# EAGLE design qo-100-pa-bias-controller (EAGLE 9.6.1)
CNAME: None; CREVISION: 1; DESIGNER: Joao Silva

## Sheet 1 of 3: MCU
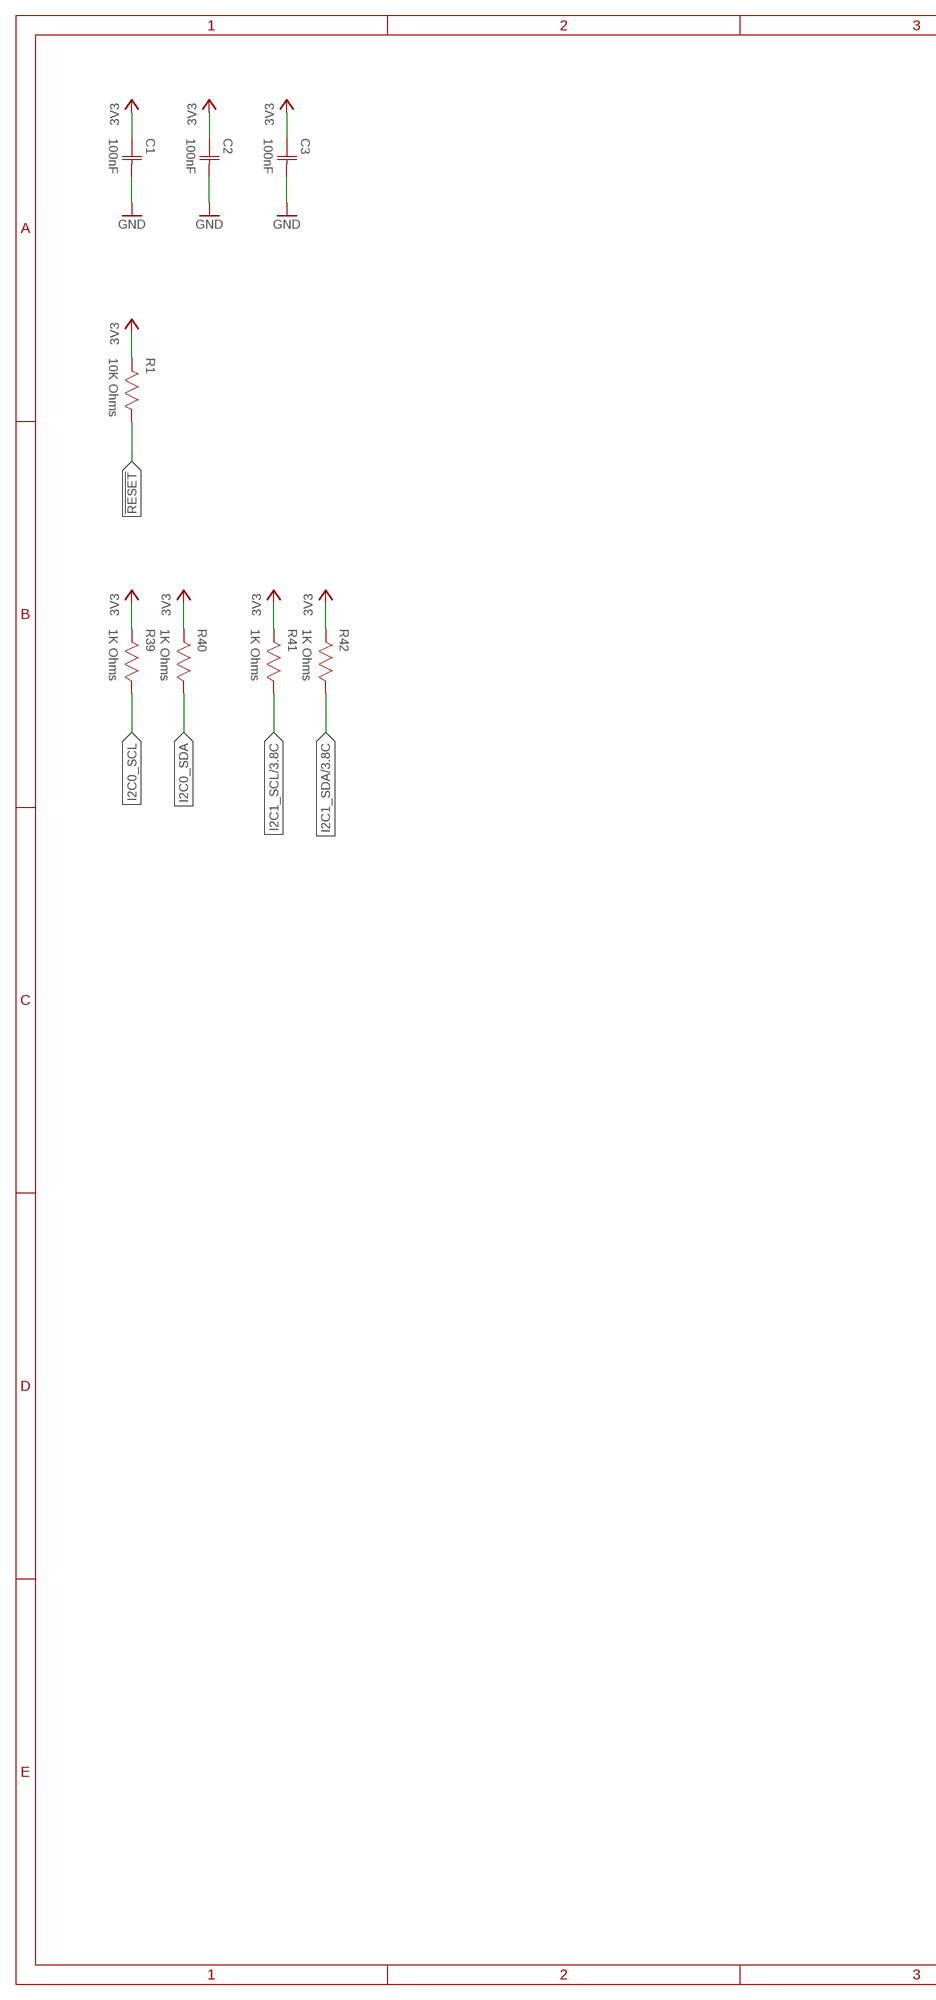
[diagram p0: schematic, sheet 1, part 1 of 2]
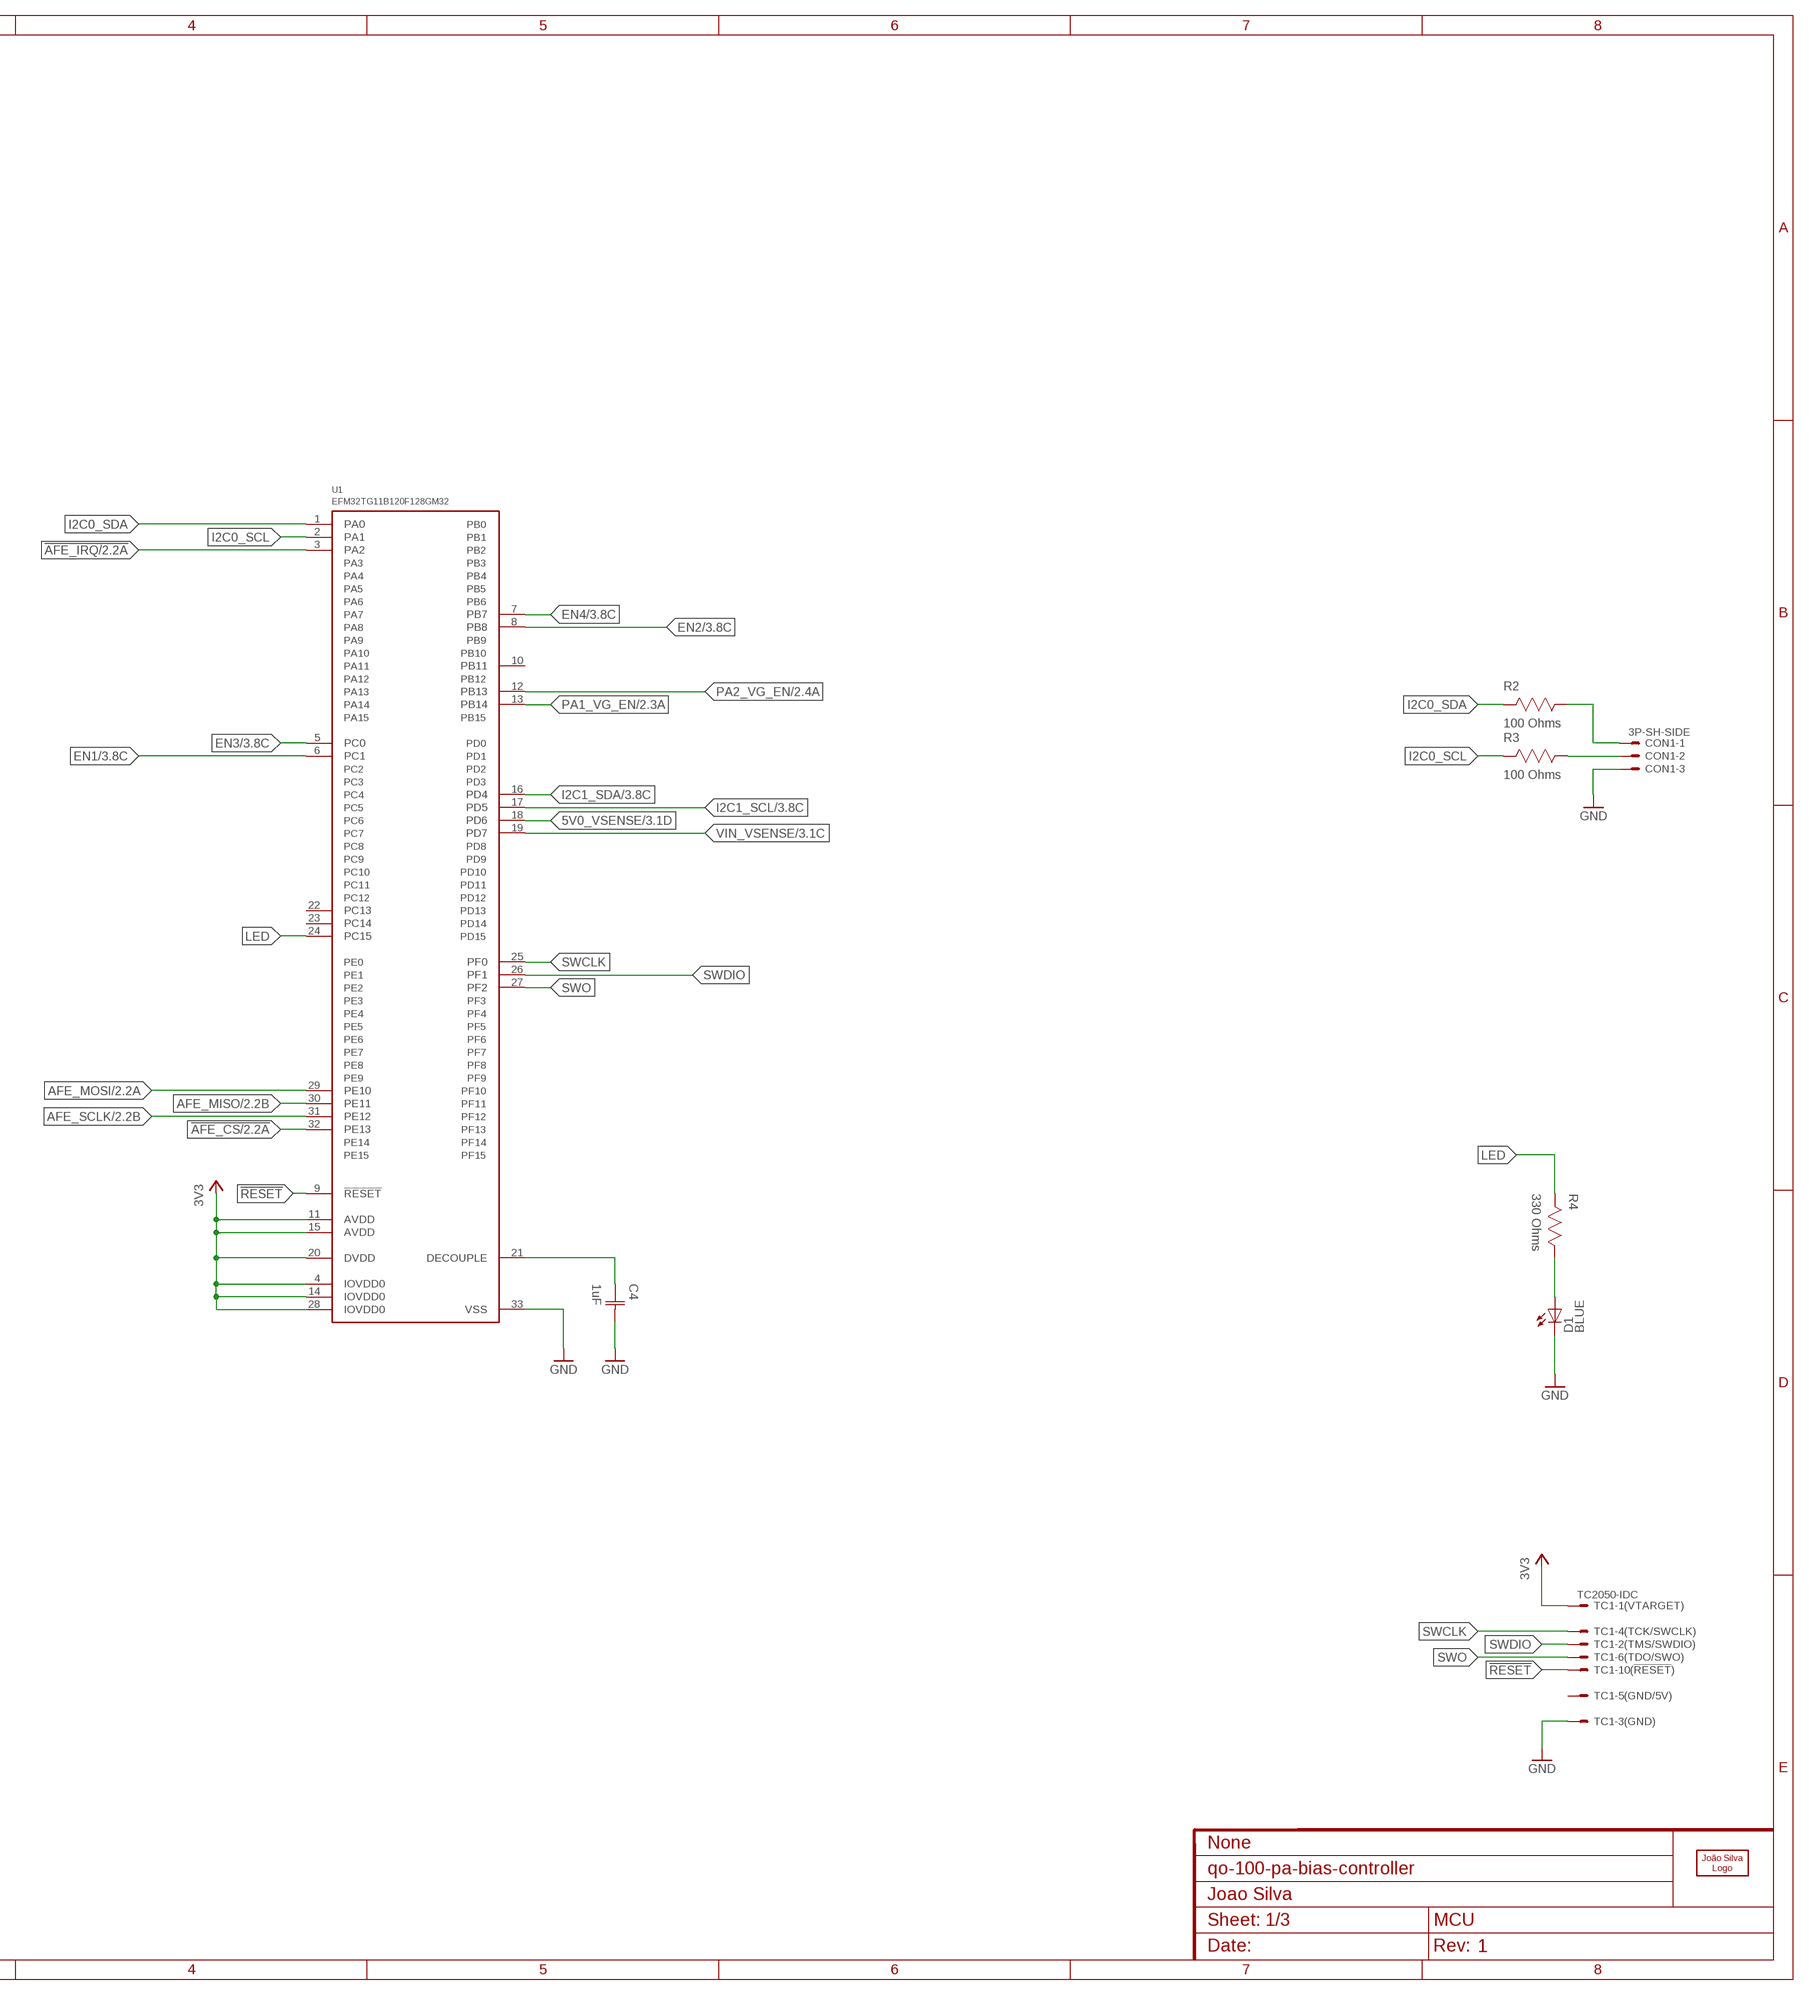
[diagram p1: schematic, sheet 1, part 2 of 2]

### Parts
C1  100nF  CAPACITOR-0603  [CAP0603]
C2  100nF  CAPACITOR-0603  [CAP0603]
C3  100nF  CAPACITOR-0603  [CAP0603]
C4  1uF  CAPACITOR-0603  [CAP0603]
CON1  3P-SH-SIDE  [SH-03-SIDE]
D1  LED0603  [0603]
LOGO1  JS-10MM  [JS_10MM]
R1  10K Ohms  RESISTOR-0603  [RES0603]
R2  100 Ohms  RESISTOR-0603  [RES0603]
R3  100 Ohms  RESISTOR-0603  [RES0603]
R4  330 Ohms  RESISTOR-0603  [RES0603]
R39  1K Ohms  RESISTOR-0603  [RES0603]
R40  1K Ohms  RESISTOR-0603  [RES0603]
R41  1K Ohms  RESISTOR-0603  [RES0603]
R42  1K Ohms  RESISTOR-0603  [RES0603]
TC1  TC2050-IDC  [TC2050-IDC]
U1  EFM32TG11B120F128GM32  [QFN32_0.5P_TG]

### Nets
3V3: C1.1(C1) C2.1(C1) C3.1(C1) R1.2 R39.2 R40.2 R41.2 R42.2 TC1.1 U1.4(IOVDD0) U1.11(AVDD) U1.14(IOVDD0) U1.15(AVDD) U1.20(DVDD) U1.28(IOVDD0) ; also sheet 2,3
5V0_VSENSE: U1.18(PD6) ; also sheet 3
!AFE_CS: U1.32(PE13) ; also sheet 2
!AFE_IRQ: U1.3(PA2) ; also sheet 2
!RESET: R1.1 TC1.10 U1.9(!RESET)
AFE_MISO: U1.30(PE11) ; also sheet 2
AFE_MOSI: U1.29(PE10) ; also sheet 2
AFE_SCLK: U1.31(PE12) ; also sheet 2
EN1: U1.6(PC1) ; also sheet 3
EN2: U1.8(PB8) ; also sheet 3
EN3: U1.5(PC0) ; also sheet 3
EN4: U1.7(PB7) ; also sheet 3
GND: C1.2(C2) C2.2(C2) C3.2(C2) C4.2(C2) CON1.3 D1.C TC1.3 U1.33(VSS) ; also sheet 2,3
I2C0_SCL: R3.2 R39.1 U1.2(PA1)
I2C0_SDA: R2.2 R40.1 U1.1(PA0)
I2C1_SCL: R41.1 U1.17(PD5) ; also sheet 3
I2C1_SDA: R42.1 U1.16(PD4) ; also sheet 3
LED: R4.2 U1.24(PC15)
N$4: CON1.2 R3.1
N$6: C4.1(C1) U1.21(DECOUPLE)
N$25: D1.A R4.1
N$38: CON1.1 R2.1
PA1_VG_EN: U1.13(PB14) ; also sheet 2
PA2_VG_EN: U1.12(PB13) ; also sheet 2
SWCLK: TC1.4 U1.25(PF0)
SWDIO: TC1.2 U1.26(PF1)
SWO: TC1.6 U1.27(PF2)
VIN_VSENSE: U1.19(PD7) ; also sheet 3
Unconnected: TC1.5 TC1.7 TC1.8 TC1.9 U1.10(PB11) U1.22(PC13) U1.23(PC14)

## Sheet 2 of 3: Analog Frontend
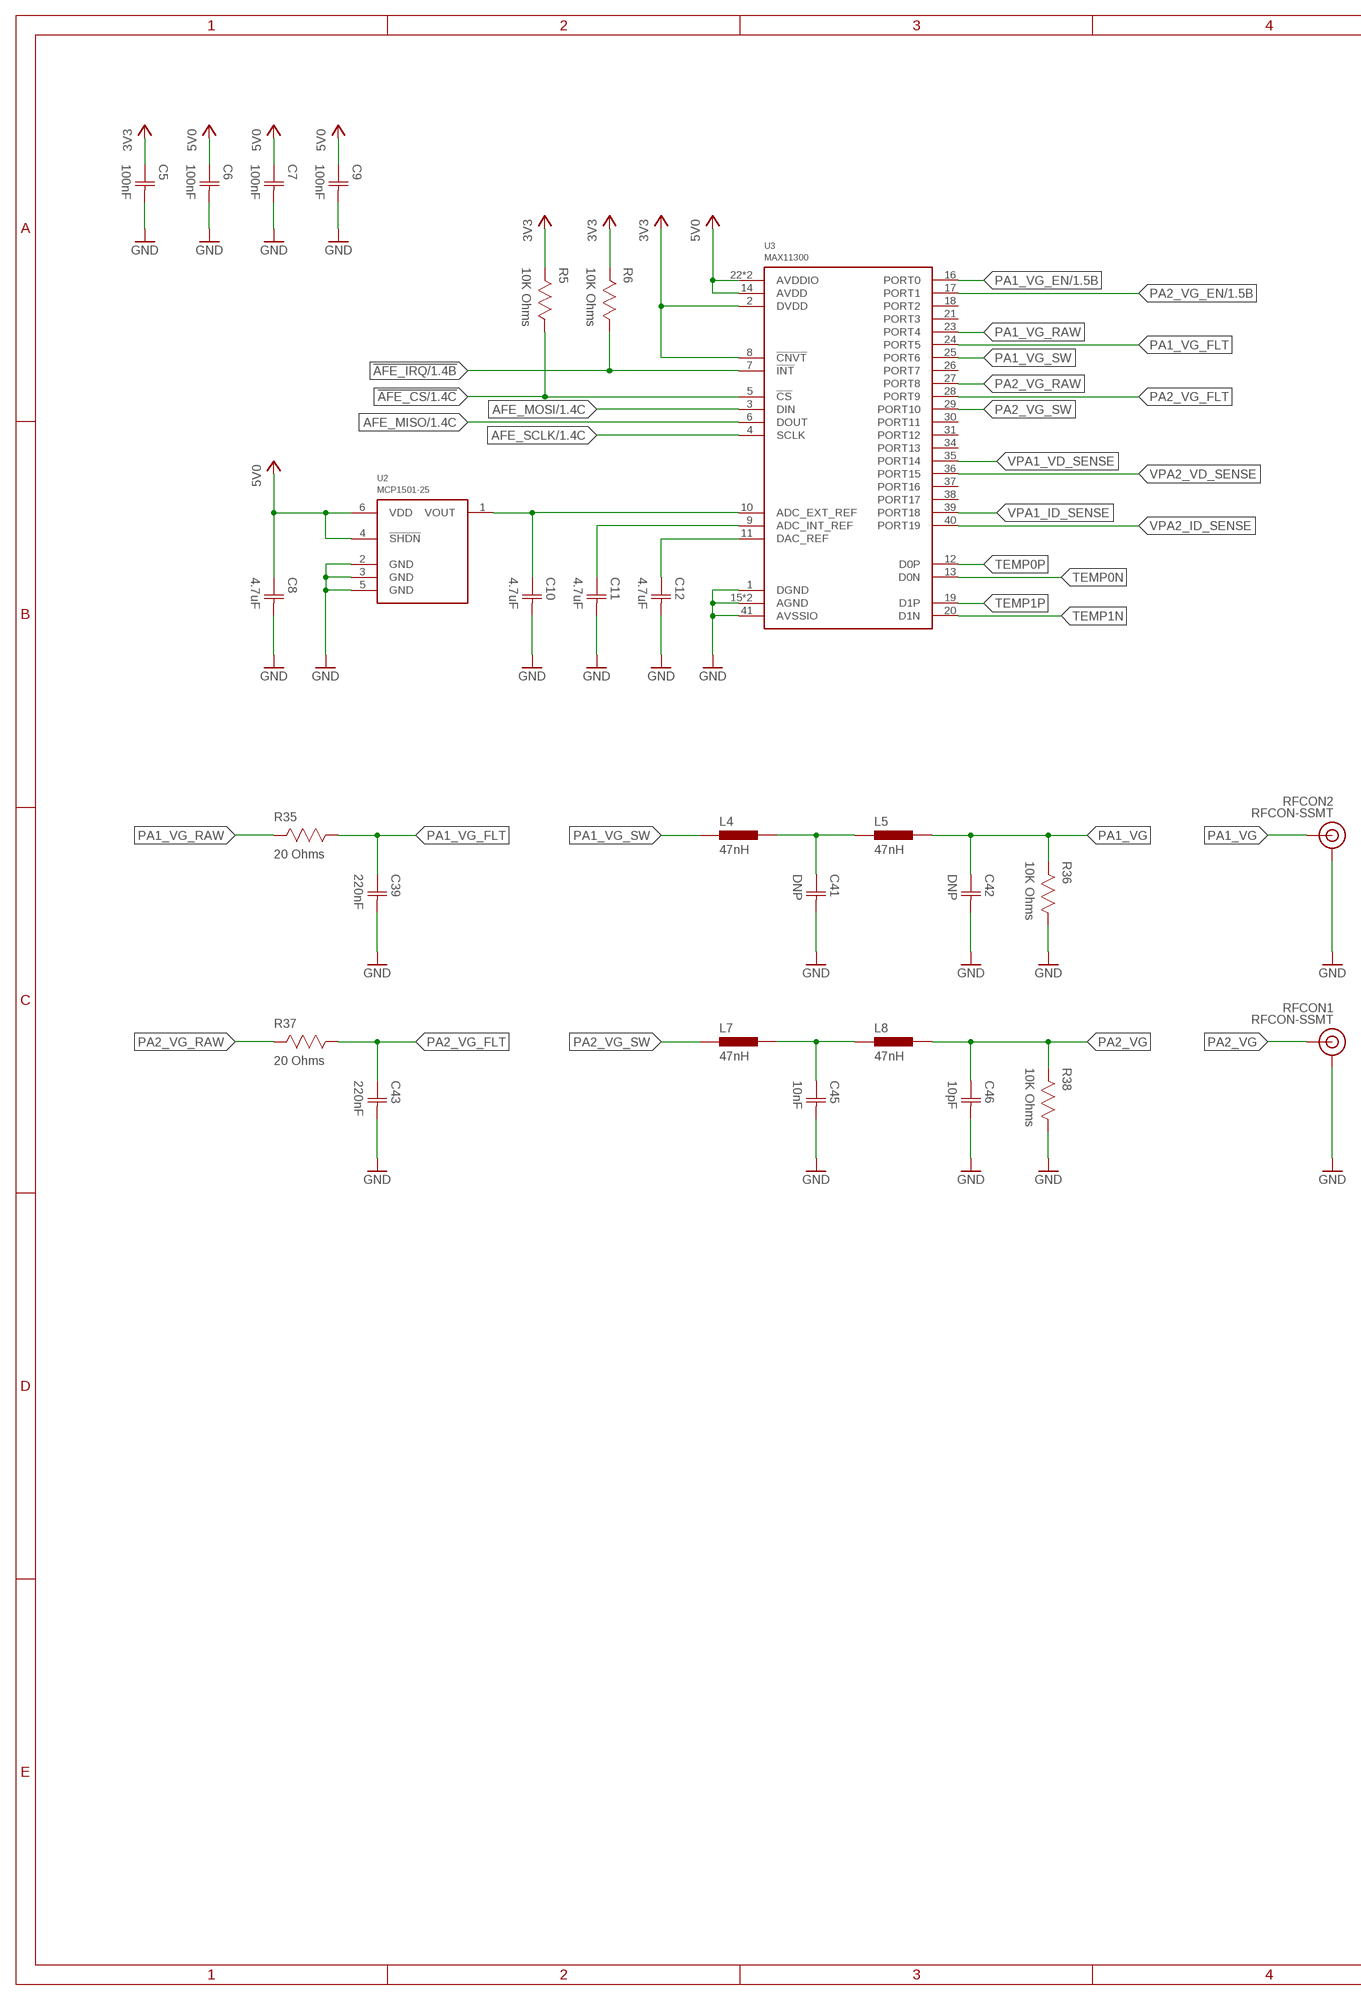
[diagram p2: schematic, sheet 2, part 1 of 2]
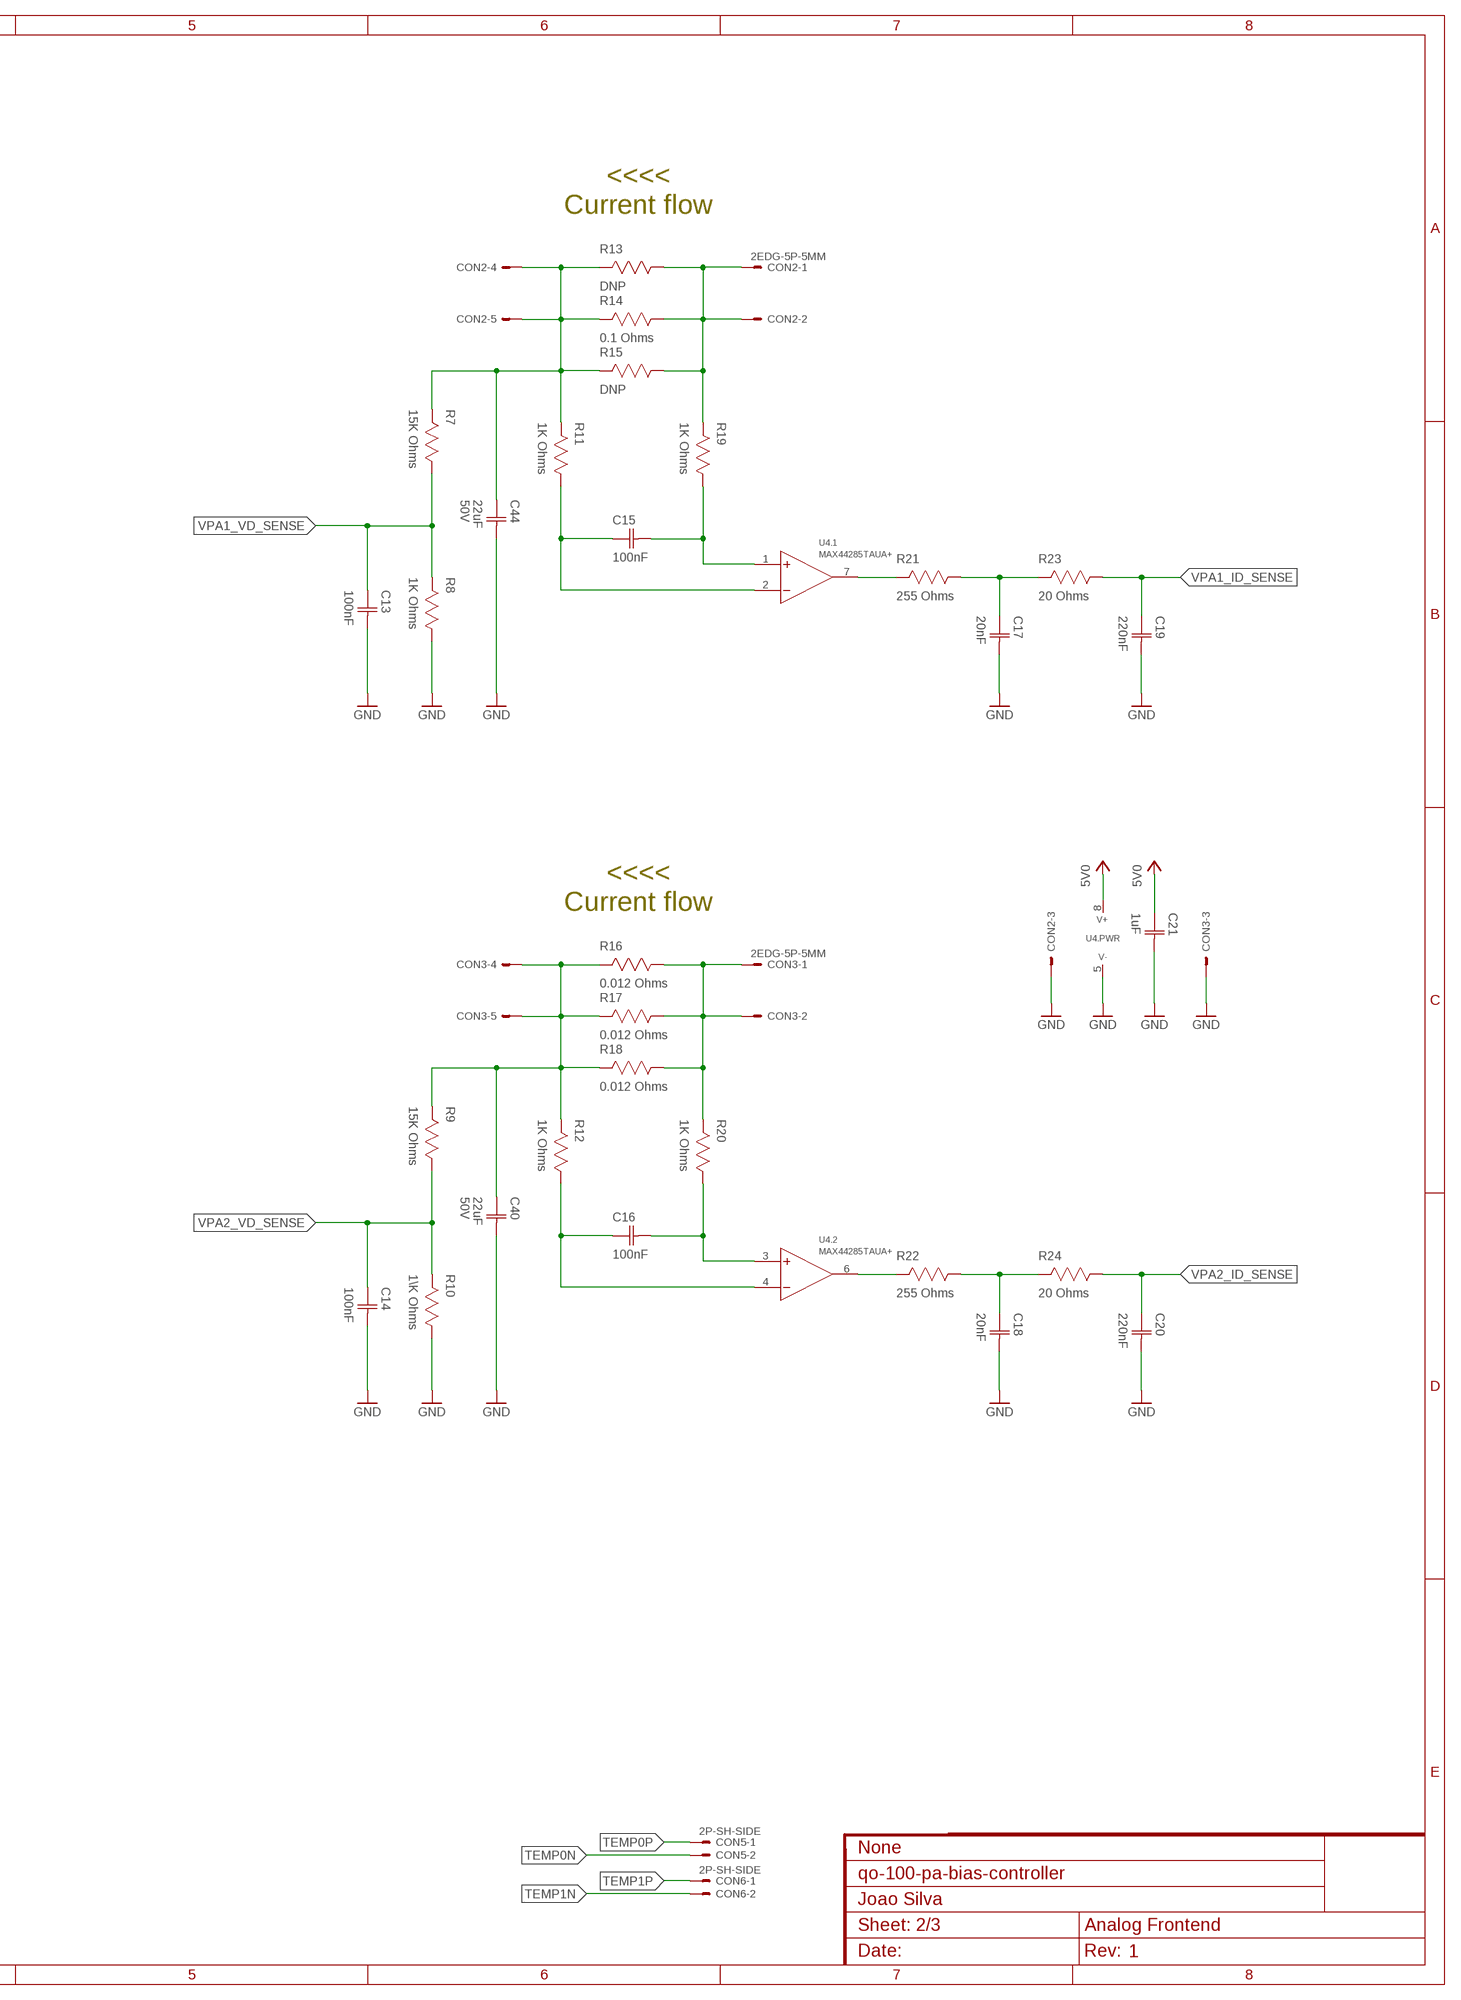
[diagram p3: schematic, sheet 2, part 2 of 2]

### Parts
C5  100nF  CAPACITOR-0603  [CAP0603]
C6  100nF  CAPACITOR-0603  [CAP0603]
C7  100nF  CAPACITOR-0603  [CAP0603]
C8  4.7uF  CAPACITOR-0603  [CAP0603]
C9  100nF  CAPACITOR-0603  [CAP0603]
C10  4.7uF  CAPACITOR-0603  [CAP0603]
C11  4.7uF  CAPACITOR-0603  [CAP0603]
C12  4.7uF  CAPACITOR-0603  [CAP0603]
C13  100nF  CAPACITOR-0603  [CAP0603]
C14  100nF  CAPACITOR-0603  [CAP0603]
C15  100nF  CAPACITOR-0603  [CAP0603]
C16  100nF  CAPACITOR-0603  [CAP0603]
C17  20nF  CAPACITOR-0603  [CAP0603]
C18  20nF  CAPACITOR-0603  [CAP0603]
C19  220nF  CAPACITOR-0603  [CAP0603]
C20  220nF  CAPACITOR-0603  [CAP0603]
C21  1uF  CAPACITOR-0603  [CAP0603]
C39  220nF  CAPACITOR-0603  [CAP0603]
C40  22uF  CAPACITOR-2220  [CAP2220]
C41  DNP  CAPACITOR-0603  [CAP0603]
C42  DNP  CAPACITOR-0603  [CAP0603]
C43  220nF  CAPACITOR-0603  [CAP0603]
C44  22uF  CAPACITOR-2220  [CAP2220]
C45  10nF  CAPACITOR-0603  [CAP0603]
C46  10pF  CAPACITOR-0603  [CAP0603]
CON2  2EDG-5P-5MM  [2EDG-5P-5MM]
CON3  2EDG-5P-5MM  [2EDG-5P-5MM]
CON5  2P-SH-SIDE  [SH-02-SIDE]
CON6  2P-SH-SIDE  [SH-02-SIDE]
L4  47nH  INDUCTOR-0603  [IND0603]
L5  47nH  INDUCTOR-0603  [IND0603]
L7  47nH  INDUCTOR-0603  [IND0603]
L8  47nH  INDUCTOR-0603  [IND0603]
R5  10K Ohms  RESISTOR-0603  [RES0603]
R6  10K Ohms  RESISTOR-0603  [RES0603]
R7  15K Ohms  RESISTOR-0603  [RES0603]
R8  1K Ohms  RESISTOR-0603  [RES0603]
R9  15K Ohms  RESISTOR-0603  [RES0603]
R10  1\K Ohms  RESISTOR-0603  [RES0603]
R11  1K Ohms  RESISTOR-0603  [RES0603]
R12  1K Ohms  RESISTOR-0603  [RES0603]
R13  DNP  RESISTOR-2512  [RES2512]
R14  0.1 Ohms  RESISTOR-2512  [RES2512]
R15  DNP  RESISTOR-2512  [RES2512]
R16  0.012 Ohms  RESISTOR-2512  [RES2512]
R17  0.012 Ohms  RESISTOR-2512  [RES2512]
R18  0.012 Ohms  RESISTOR-2512  [RES2512]
R19  1K Ohms  RESISTOR-0603  [RES0603]
R20  1K Ohms  RESISTOR-0603  [RES0603]
R21  255 Ohms  RESISTOR-0603  [RES0603]
R22  255 Ohms  RESISTOR-0603  [RES0603]
R23  20 Ohms  RESISTOR-0603  [RES0603]
R24  20 Ohms  RESISTOR-0603  [RES0603]
R35  20 Ohms  RESISTOR-0603  [RES0603]
R36  10K Ohms  RESISTOR-0603  [RES0603]
R37  20 Ohms  RESISTOR-0603  [RES0603]
R38  10K Ohms  RESISTOR-0603  [RES0603]
RFCON1  RFCON-SSMT  [SSMT]
RFCON2  RFCON-SSMT  [SSMT]
U2  MCP1501-25  [SOT23-6]
U3  MAX11300  [QFN40]
U4  MAX44285TAUA+  [MSOP8]

### Nets
3V3: C5.1(C1) R5.2 R6.2 U3.2(DVDD) U3.8(!CNVT) ; also sheet 1,3
5V0: C6.1(C1) C7.1(C1) C8.1(C1) C9.1(C1) C21.1(C1) U2.4(!SHDN) U2.6(VDD) U3.14(AVDD) U3.22(AVDDIO) U3.33(AVDDIO) U4.8(.PWR:V+) ; also sheet 3
!AFE_CS: R5.1 U3.5(!CS) ; also sheet 1
!AFE_IRQ: R6.1 U3.7(!INT) ; also sheet 1
AFE_ADC_EXT_REF: C10.1(C1) U2.1(VOUT) U3.10(ADC_EXT_REF)
AFE_ADC_INT_REF: C11.1(C1) U3.9(ADC_INT_REF)
AFE_DAC_REF: C12.1(C1) U3.11(DAC_REF)
AFE_MISO: U3.6(DOUT) ; also sheet 1
AFE_MOSI: U3.3(DIN) ; also sheet 1
AFE_SCLK: U3.4(SCLK) ; also sheet 1
GND: C5.2(C2) C6.2(C2) C7.2(C2) C8.2(C2) C9.2(C2) C10.2(C2) C11.2(C2) C12.2(C2) C13.2(C2) C14.2(C2) C17.2(C2) C18.2(C2) C19.2(C2) C20.2(C2) C21.2(C2) C39.2(C2) C40.2(C2) C41.2(C2) C42.2(C2) C43.2(C2) C44.2(C2) C45.2(C2) C46.2(C2) CON2.P$3 CON3.P$3 R8.1 R10.1 R36.1 R38.1 RFCON1.1(GND) RFCON1.3(GND) RFCON1.4(GND) RFCON2.1(GND) RFCON2.3(GND) RFCON2.4(GND) U2.2(GND) U2.3(GND) U2.5(GND) U3.1(DGND) U3.15(AGND) U3.32(AGND) U3.41(AVSSIO) U4.5(.PWR:V-) ; also sheet 1,3
N$1: R22.2 U4.6(.2:OUT)
N$2: C18.1(C1) R22.1 R24.2
N$3: R21.2 U4.7(.1:OUT)
N$5: C17.1(C1) R21.1 R23.2
N$8: C41.1(C1) L4.2 L5.1
N$10: C45.1(C1) L7.2 L8.1
PA1_VD_IN [80V isolation]: CON2.P$1 CON2.P$2 R13.1 R14.1 R15.1 R19.2
PA1_VD_OUT [80V isolation]: C44.1(C1) CON2.P$4 CON2.P$5 R7.2 R11.2 R13.2 R14.2 R15.2
PA1_VG: C42.1(C1) L5.2 R36.2 RFCON2.2(SIGNAL)
PA1_VG_EN: U3.16(PORT0) ; also sheet 1
PA1_VG_FLT: C39.1(C1) R35.1 U3.24(PORT5)
PA1_VG_RAW: R35.2 U3.23(PORT4)
PA1_VG_SW: L4.1 U3.25(PORT6)
PA2_VD_IN [80V isolation]: CON3.P$1 CON3.P$2 R16.1 R17.1 R18.1 R20.2
PA2_VD_OUT [80V isolation]: C40.1(C1) CON3.P$4 CON3.P$5 R9.2 R12.2 R16.2 R17.2 R18.2
PA2_VG: C46.1(C1) L8.2 R38.2 RFCON1.2(SIGNAL)
PA2_VG_EN: U3.17(PORT1) ; also sheet 1
PA2_VG_FLT: C43.1(C1) R37.1 U3.28(PORT9)
PA2_VG_RAW: R37.2 U3.27(PORT8)
PA2_VG_SW: L7.1 U3.29(PORT10)
TEMP0N: CON5.2 U3.13(D0N)
TEMP0P: CON5.1 U3.12(D0P)
TEMP1N: CON6.2 U3.20(D1N)
TEMP1P: CON6.1 U3.19(D1P)
VPA1_ID_SENSE: C19.1(C1) R23.1 U3.39(PORT18)
VPA1_ID_SENSE_N [80V isolation]: C15.1(C1) R11.1 U4.2(.1:-IN)
VPA1_ID_SENSE_P [80V isolation]: C15.2(C2) R19.1 U4.1(.1:+IN)
VPA1_VD_SENSE: C13.1(C1) R7.1 R8.2 U3.35(PORT14)
VPA2_ID_SENSE: C20.1(C1) R24.1 U3.40(PORT19)
VPA2_ID_SENSE_N [80V isolation]: C16.1(C1) R12.1 U4.4(.2:-IN)
VPA2_ID_SENSE_P [80V isolation]: C16.2(C2) R20.1 U4.3(.2:+IN)
VPA2_VD_SENSE: C14.1(C1) R9.1 R10.2 U3.36(PORT15)
Unconnected: U3.18(PORT2) U3.21(PORT3) U3.26(PORT7) U3.30(PORT11) U3.31(PORT12) U3.34(PORT13) U3.37(PORT16) U3.38(PORT17)

### Notes on the sheet
- <<<<
  Current flow
- <<<<
  Current flow

## Sheet 3 of 3: Power
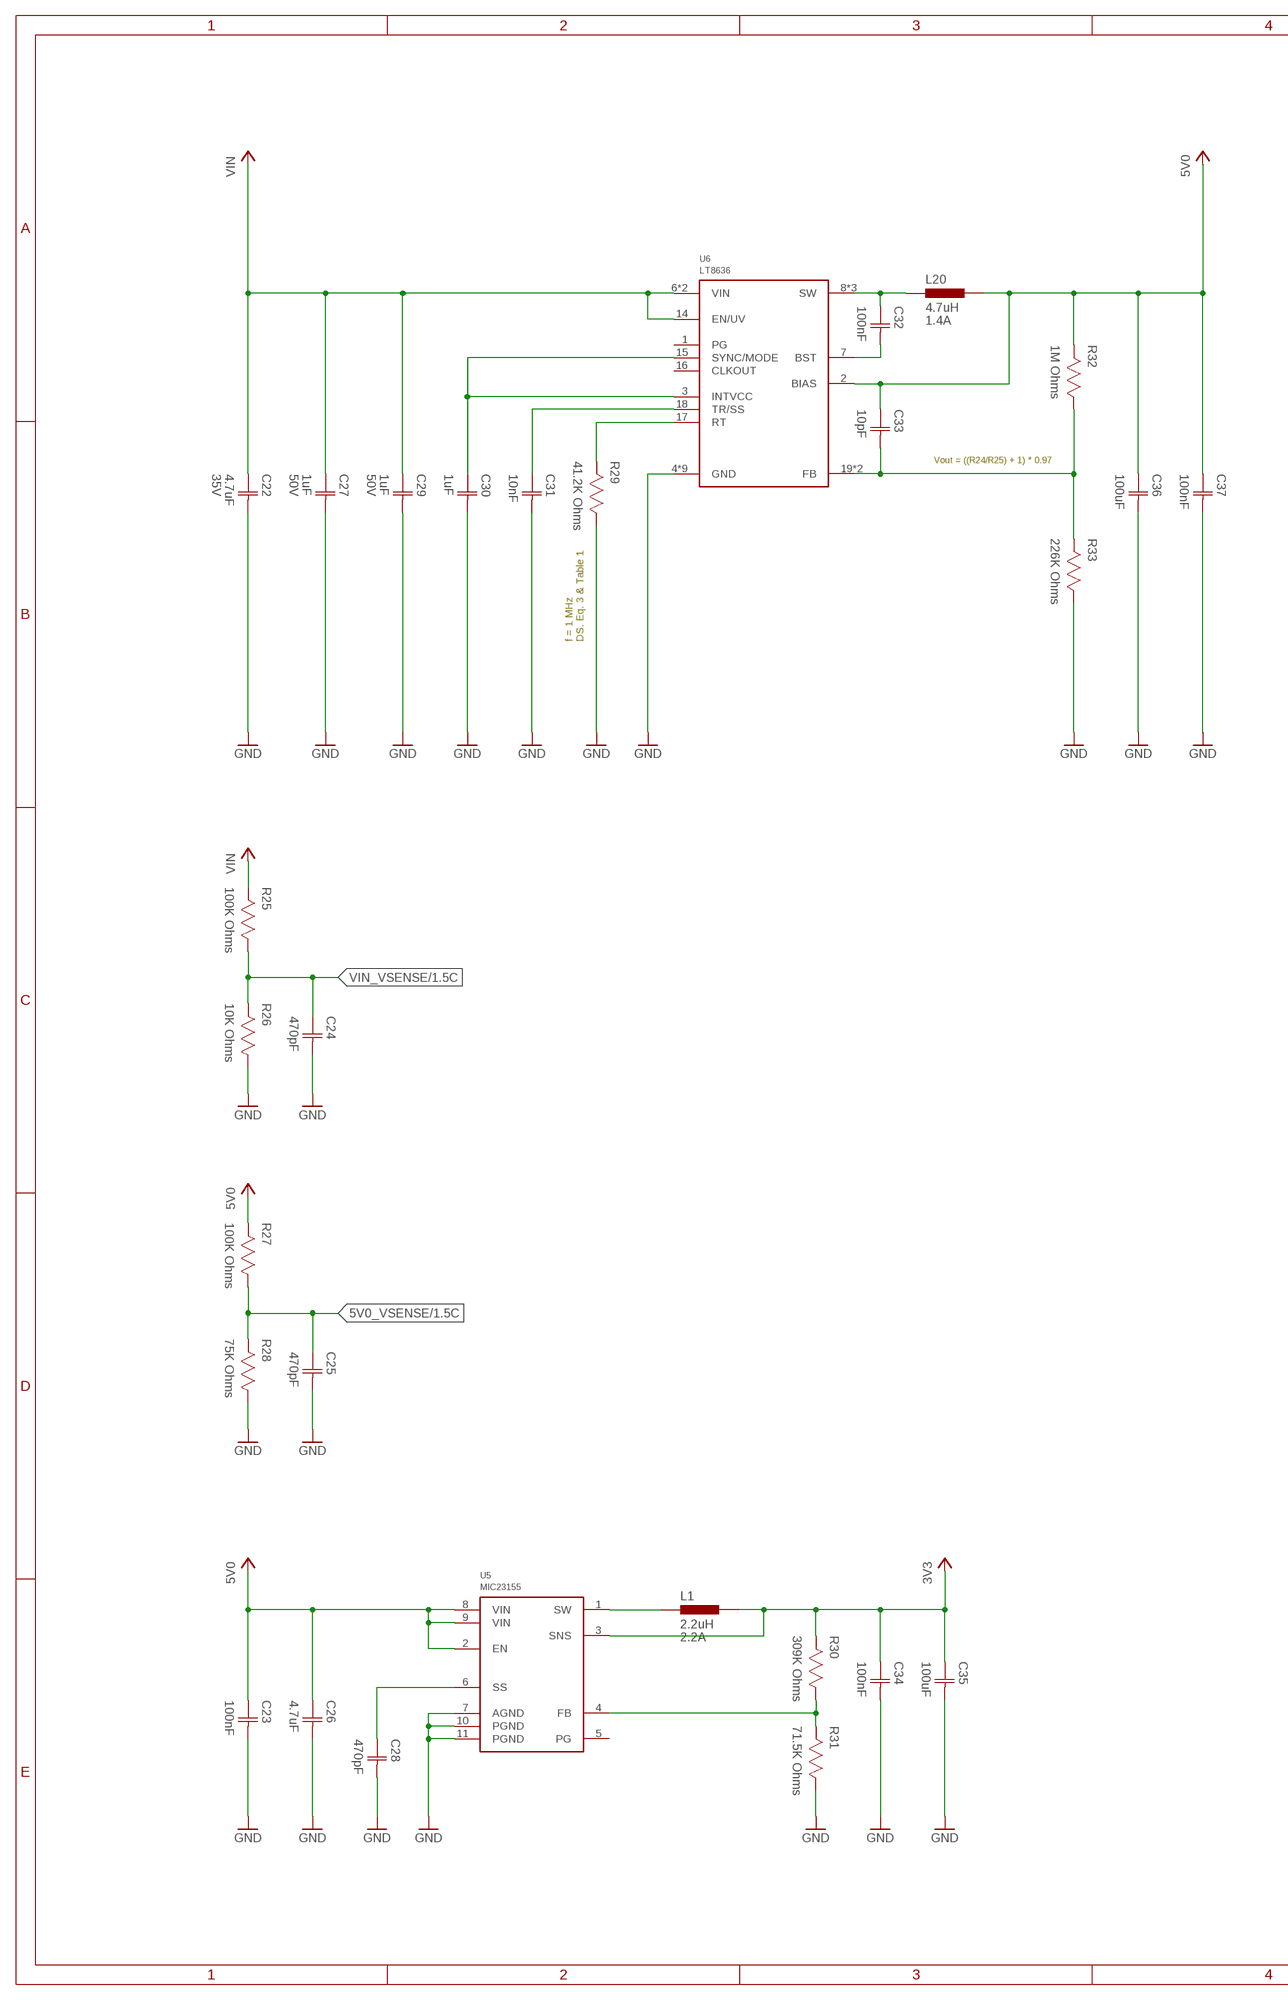
[diagram p4: schematic, sheet 3, part 1 of 2]
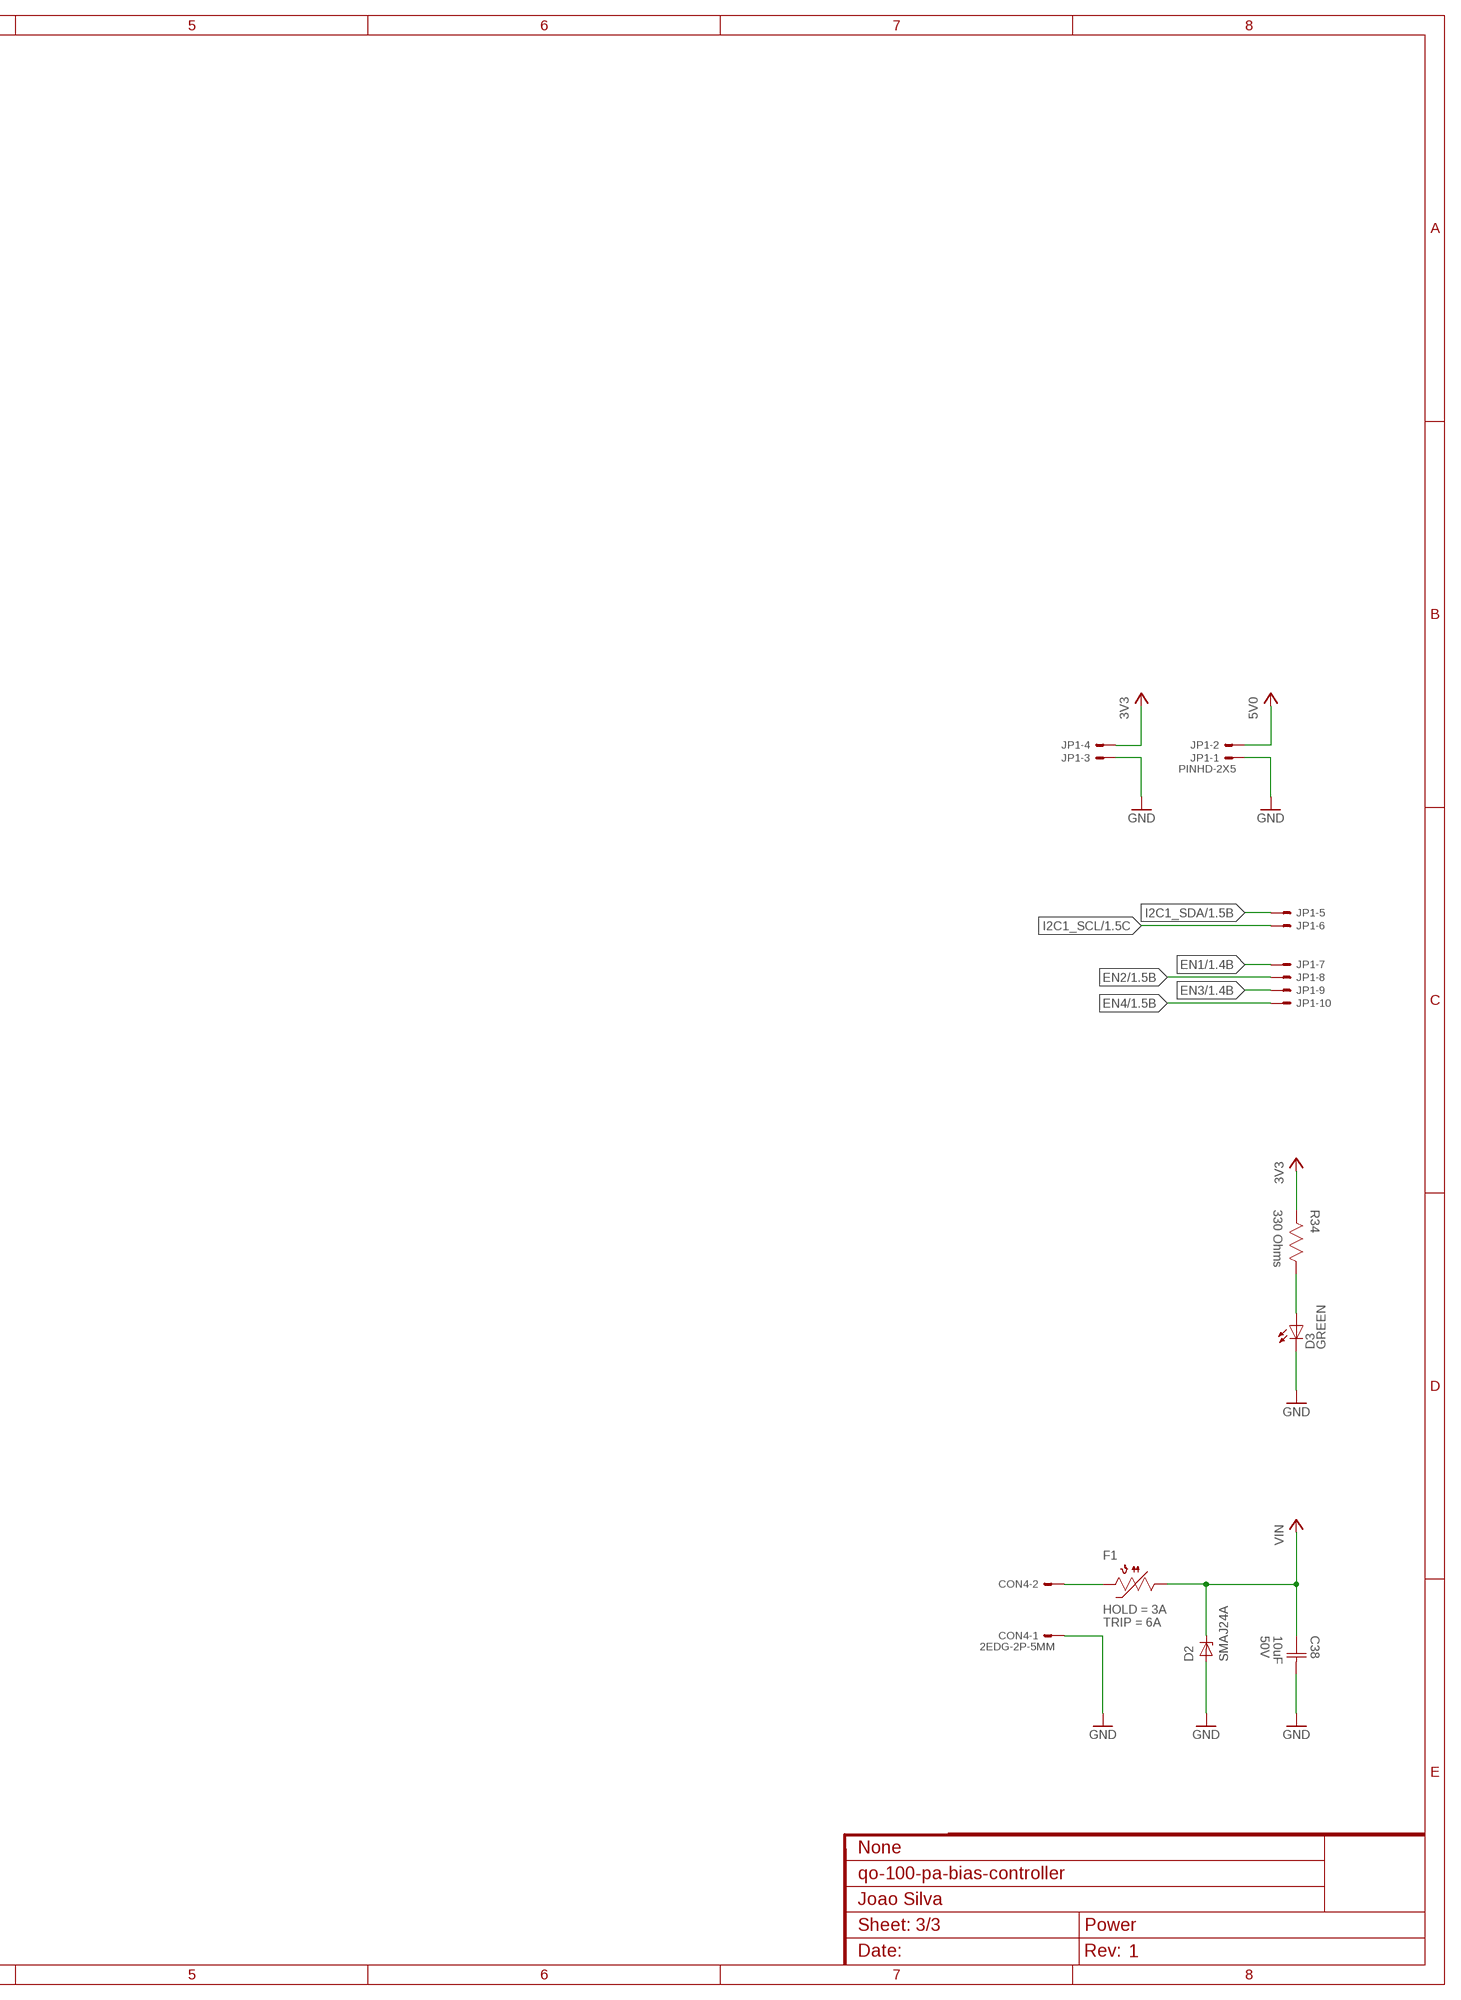
[diagram p5: schematic, sheet 3, part 2 of 2]

### Parts
C22  4.7uF  CAPACITOR-0603  [CAP0603]
C23  100nF  CAPACITOR-0603  [CAP0603]
C24  470pF  CAPACITOR-0603  [CAP0603]
C25  470pF  CAPACITOR-0603  [CAP0603]
C26  4.7uF  CAPACITOR-0603  [CAP0603]
C27  1uF  CAPACITOR-0603  [CAP0603]
C28  470pF  CAPACITOR-0603  [CAP0603]
C29  1uF  CAPACITOR-0603  [CAP0603]
C30  1uF  CAPACITOR-0603  [CAP0603]
C31  10nF  CAPACITOR-0603  [CAP0603]
C32  100nF  CAPACITOR-0603  [CAP0603]
C33  10pF  CAPACITOR-0603  [CAP0603]
C34  100nF  CAPACITOR-0603  [CAP0603]
C35  100uF  CAPACITOR-1206  [CAP1206]
C36  100uF  CAPACITOR-1206  [CAP1206]
C37  100nF  CAPACITOR-0603  [CAP0603]
C38  10uF  CAPACITOR-1206  [CAP1206]
CON4  2EDG-2P-5MM  [2EDG-2P-5MM]
D2  SMAJ24A  [DO214AC]
D3  LED0603  [0603]
F1  2.6A Hold  PTC1206  [1206]
JP1  PINHD-2X5  [2X05]
L1  2.2uH  INDUCTOR-2.5X2X1.2MM  [IND2520]
L20  4.7uH  INDUCTOR-2.5X2X1.2MM  [IND2520]
R25  100K Ohms  RESISTOR-0603  [RES0603]
R26  10K Ohms  RESISTOR-0603  [RES0603]
R27  100K Ohms  RESISTOR-0603  [RES0603]
R28  75K Ohms  RESISTOR-0603  [RES0603]
R29  41.2K Ohms  RESISTOR-0603  [RES0603]
R30  309K Ohms  RESISTOR-0603  [RES0603]
R31  71.5K Ohms  RESISTOR-0603  [RES0603]
R32  1M Ohms  RESISTOR-0603  [RES0603]
R33  226K Ohms  RESISTOR-0603  [RES0603]
R34  330 Ohms  RESISTOR-0603  [RES0603]
U5  MIC23155  [DFN10]
U6  LT8636  [QFN20_ASYM_CORNER]

### Nets
3V3: C34.1(C1) C35.1(C1) JP1.4 L1.2 R30.2 R34.2 U5.3(SNS) ; also sheet 1,2
3V3_FB: R30.1 R31.2 U5.4(FB)
3V3_SOFTSTART: C28.1(C1) U5.6(SS)
3V3_SW: L1.1 U5.1(SW)
5V0: C23.1(C1) C26.1(C1) C33.1(C1) C36.1(C1) C37.1(C1) JP1.2 L20.2 R27.2 R32.2 U5.2(EN) U5.8(VIN) U5.9(VIN) U6.2(BIAS) ; also sheet 2
5V0_BST: C32.2(C2) U6.7(BST)
5V0_FB: C33.2(C2) R32.1 R33.2 U6.19(FB) U6.20(FB)
5V0_INTVCC: C30.1(C1) U6.3(INTVCC) U6.15(SYNC/MODE)
5V0_RT: R29.2 U6.17(RT)
5V0_SS: C31.1(C1) U6.18(TR/SS)
5V0_SW: C32.1(C1) L20.1 U6.8(SW) U6.9(SW) U6.10(SW)
5V0_VSENSE: C25.1(C1) R27.1 R28.2 ; also sheet 1
EN1: JP1.7 ; also sheet 1
EN2: JP1.8 ; also sheet 1
EN3: JP1.9 ; also sheet 1
EN4: JP1.10 ; also sheet 1
GND: C22.2(C2) C23.2(C2) C24.2(C2) C25.2(C2) C26.2(C2) C27.2(C2) C28.2(C2) C29.2(C2) C30.2(C2) C31.2(C2) C34.2(C2) C35.2(C2) C36.2(C2) C37.2(C2) C38.2(C2) CON4.P$1 D2.A D3.C JP1.1 JP1.3 R26.1 R28.1 R29.1 R31.1 R33.1 U5.7(AGND) U5.10(PGND) U5.11(PGND) U6.4(GND) U6.5(GND) U6.12(GND) U6.13(GND) U6.21(GND) U6.M1(GND) U6.M2(GND) U6.M3(GND) U6.M4(GND) ; also sheet 1,2
I2C1_SCL: JP1.6 ; also sheet 1
I2C1_SDA: JP1.5 ; also sheet 1
N$19: CON4.P$2 F1.2
N$149: D3.A R34.1
VIN: C22.1(C1) C27.1(C1) C29.1(C1) C38.1(C1) D2.C F1.1 R25.2 U6.6(VIN) U6.11(VIN) U6.14(EN/UV)
VIN_VSENSE: C24.1(C1) R25.1 R26.2 ; also sheet 1
Unconnected: U5.5(PG) U6.1(PG) U6.16(CLKOUT)

### Notes on the sheet
- Vout = ((R24/R25) + 1) * 0.97
- f = 1 MHz
  DS. Eq. 3 & Table 1

## Library data of the parts
C1-C21 C23-C26 C28 C30-C37 C39 C41-C43 C45 C46 = Capacitor:CAPACITOR
C22 = Capacitor:CAPACITOR; VOLTAGE: 35V
C27 C29 C38 C40 C44 = Capacitor:CAPACITOR; VOLTAGE: 50V
CON1 = JST:3P: Disconnectable Crimp style connector, 1.0mm pitch 3 contacts
CON2 CON3 = Generic Connector:2EDG-5P
CON4 = Generic Connector:2EDG-2P
CON5 CON6 = JST:2P: Disconnectable Crimp style connector, 1.0mm pitch 2 contacts
D1 = LED:LED; COLOR: BLUE
D2 = TVS:SMAJ*A: SMAJ Series TVS Diodes Source: http://www.littelfuse.com/~/media/electronics/datasheets/tvs_diodes/littelfuse_tvs_diode_smaj_datasheet.pdf.pdf; MF: Littelfuse; MPN: SMAJ24A; OC_FARNELL: 1886345; OC_NEWARK: 06R1865
D3 = LED:LED; COLOR: GREEN
F1 = PTC Fuses:PTC; HOLD: 3A; OCLCSC: C207041; TRIP: 6A
JP1 = Pin Header:PINHD-2X5: PIN HEADER
L1 = Inductor:INDUCTOR; CURRENT: 2.2A; OCLCSC: C375952
L4 L5 L7 L8 = Inductor:INDUCTOR
L20 = Inductor:INDUCTOR; CURRENT: 1.4A; OCLCSC: C443497
LOGO1 = Silkscreen:JS
R1-R42 = Resistor:RESISTOR
RFCON1 RFCON2 = RF Connector:RFCON
TC1 = TagConnect:TC2050-IDC
U1 = EFM32:EFM32TG11B1*M32
U2 = Microchip:MCP1501-*
U3 = Maxim Integrated:MAX11300
U4 = Maxim Integrated:MAX44285*
U5 = Microchip:MIC23155
U6 = Analog Devices:LT8636

## Net classes
1 80V isolation: clearance 0.2 mm

## Board
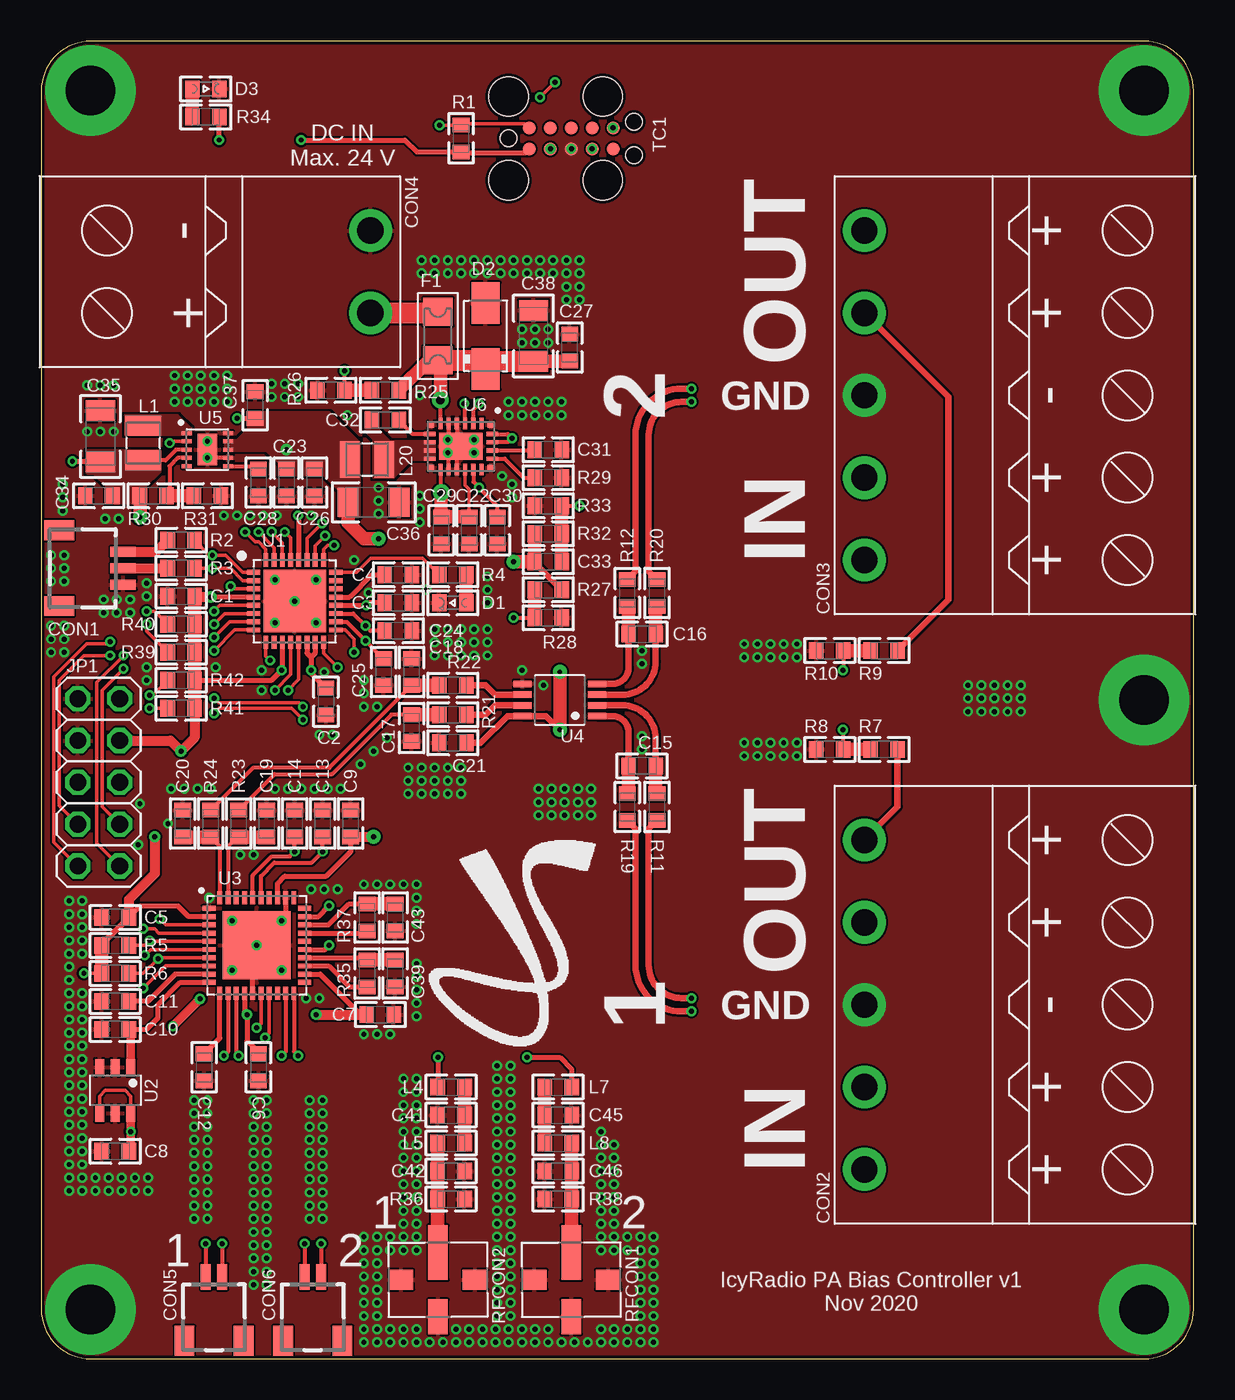
[diagram p6: board, top side]
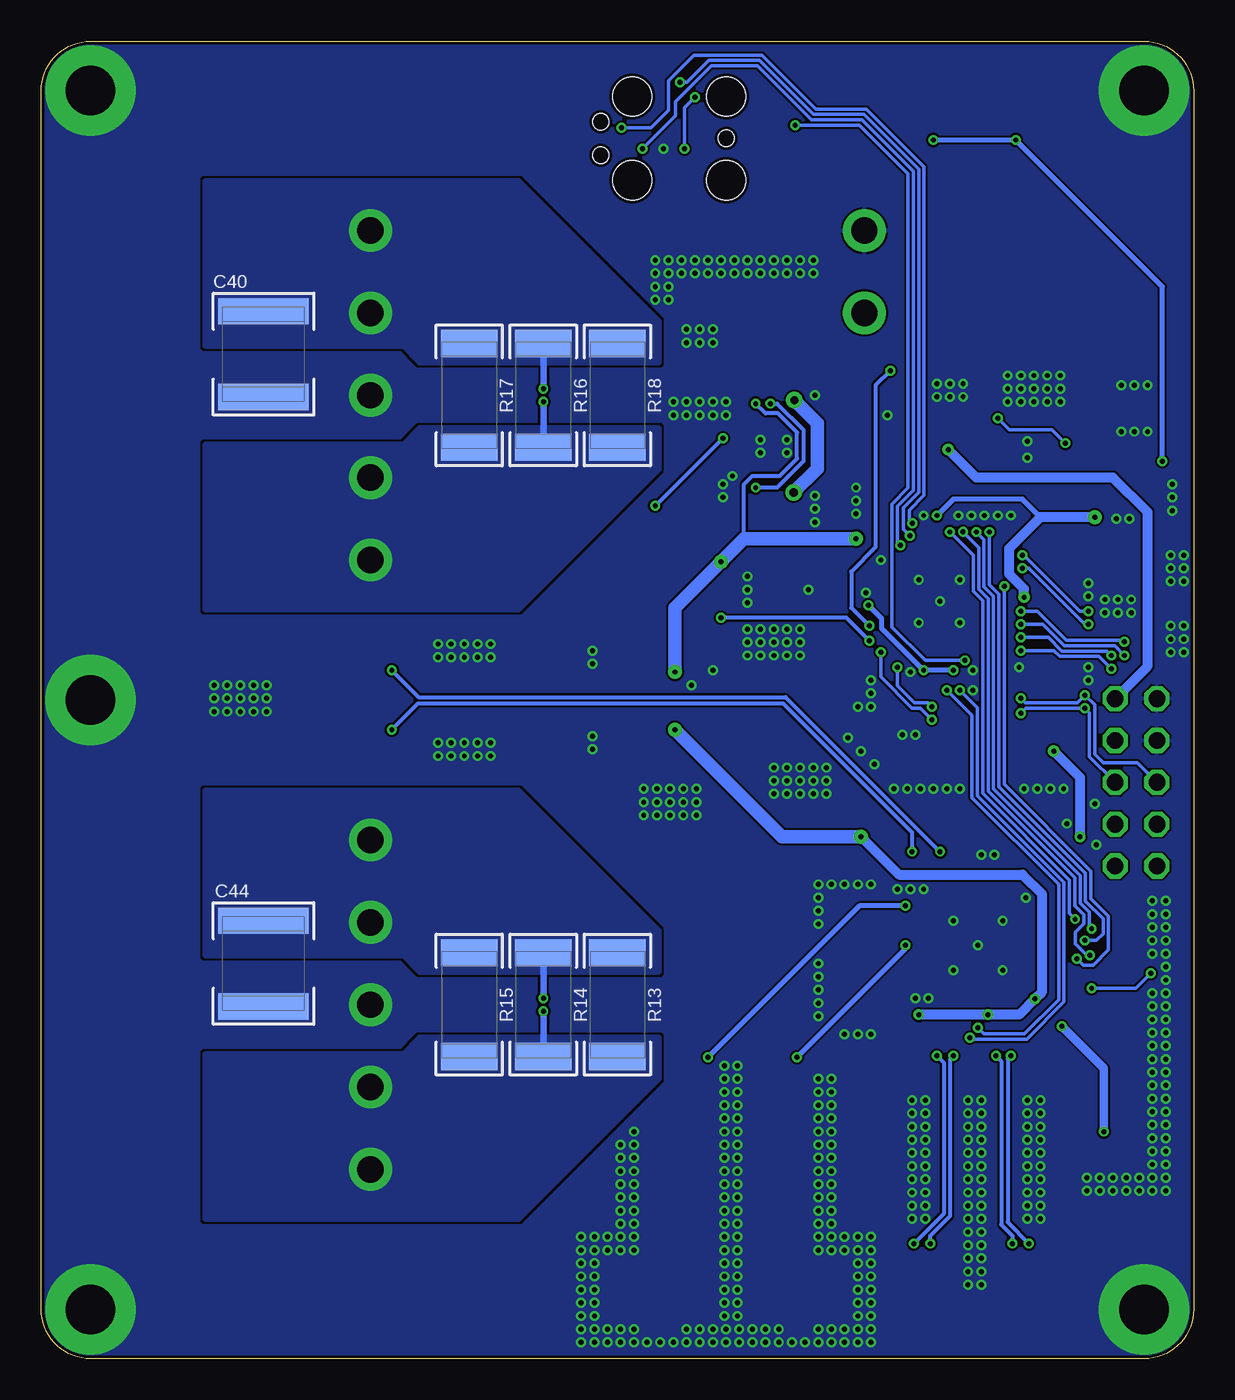
[diagram p7: board, bottom side, seen from below]

Size 70 x 80 mm. Coordinates in mm from the lower left corner, seen from the top.
Outline: 70,3 70,77 arc90 67,80 3,80 arc90 0,77 0,3 arc90 3,0 67,0 arc90 70,3
Copper layers (1*16): Top 0.035mm / dielectric 1.6mm / Bottom 0.035mm
Design rules "jlcpcb_2layer": minimum track width 5mil, minimum drill 0.3mm, track to track 5mil, track to pad 5mil, pad to pad 5mil, via to via 5mil, smd to smd 5mil, copper to edge 0.2mm, drill to drill 5mil, minimum pad ring 3mil, minimum via ring 3mil, stop-mask expansion 0.075mm, vias tented up to drill 10mm, thermal gap 5mil

### Footprints (pad centres in the part's own frame; a part is rotated, then mirrored left to right if it is on the bottom)
CAP0603 = smd 0.889 x 1.016: 1 -0.819,0; 2 0.819,0
CAP1206 = smd 1.27 x 1.778: 1 -1.549,0; 2 1.549,0
CAP2220 = smd 1.6 x 5.5: 1 -2.6,0; 2 2.6,0
SH-03-SIDE = smd 0.6 x 1.55: 1 -1,2.975; 2 0,2.975; 3 1,2.975 | smd 1.2 x 1.8: FIT@1 -2.3,-0.9; FIT@2 2.3,-0.9
2EDG-5P-5MM = drill 1.6 pad 2.6: P$1 -10,0; P$2 -5,0; P$3 0,0; P$4 5,0; P$5 10,0
2EDG-2P-5MM = drill 1.6 pad 2.6: P$1 -2.5,0; P$2 2.5,0
SH-02-SIDE = smd 0.6 x 1.55: 1 -0.5,2.975; 2 0.5,2.975 | smd 1.2 x 1.8: FIT@1 -1.8,-0.9; FIT@2 1.8,-0.9
0603 = smd 0.889 x 1.016: A 0.819,0; C -0.819,0
DO214AC = smd 2.5 x 1.7: A 2,0; C -2,0
1206 = smd 1.7 x 1.803: 1 -1.472,0; 2 1.472,0
2X05 = drill 1.016 octagon: 1 -5.08,-1.27; 2 -5.08,1.27; 3 -2.54,-1.27; 4 -2.54,1.27; 5 0,-1.27; 6 0,1.27; 7 2.54,-1.27; 8 2.54,1.27; 9 5.08,-1.27; 10 5.08,1.27
IND2520 = smd 2.2 x 1.2: 1 0,-1.05; 2 0,1.05
IND0603 = smd 0.889 x 1.016: 1 -0.819,0; 2 0.819,0
RES0603 = smd 0.889 x 1.016: 1 -0.819,0; 2 0.819,0
RES2512 = smd 1.651 x 3.429: 1 -3.15,0; 2 3.15,0
SSMT = smd 1.194 x 1.499: 1 0,-2.248; 3 0,2.248 | smd 3.302 x 1.194: 2 1.651,0 | smd 2.108 x 1.194: 4 -2.248,0
TC2050-IDC = smd 0.787 x 0.787: 1 -2.54,-0.635; 2 -1.27,-0.635; 3 0,-0.635; 4 1.27,-0.635; 5 2.54,-0.635; 6 2.54,0.635; 7 1.27,0.635; 8 0,0.635; 9 -1.27,0.635; 10 -2.54,0.635 | hole 0.991: -3.81,0; 3.81,1.016; 3.81,-1.016 | hole 2.375: -3.81,2.54; -3.81,-2.54; 1.905,2.54; 1.905,-2.54
QFN32_0.5P_TG = smd 0.8 x 0.3: 1 -2.5,1.75; 2 -2.5,1.25; 3 -2.5,0.75; 4 -2.5,0.25; 5 -2.5,-0.25; 6 -2.5,-0.75; 7 -2.5,-1.25; 8 -2.5,-1.75; 17 2.5,-1.75; 18 2.5,-1.25; 19 2.5,-0.75; 20 2.5,-0.25; 21 2.5,0.25; 22 2.5,0.75; 23 2.5,1.25; 24 2.5,1.75 | smd 0.3 x 0.8: 9 -1.75,-2.5; 10 -1.25,-2.5; 11 -0.75,-2.5; 12 -0.25,-2.5; 13 0.25,-2.5; 14 0.75,-2.5; 15 1.25,-2.5; 16 1.75,-2.5; 25 1.75,2.5; 26 1.25,2.5; 27 0.75,2.5; 28 0.25,2.5; 29 -0.25,2.5; 30 -0.75,2.5; 31 -1.25,2.5; 32 -1.75,2.5 | smd 3.8 x 3.8: 33 0,0
SOT23-6 = smd 1 x 0.55: 1 -1.4,0.95; 2 -1.4,0; 3 -1.4,-0.95; 4 1.4,-0.95; 5 1.4,0; 6 1.4,0.95
QFN40 = smd 0.8 x 0.3: 1 -2.9,2.25; 2 -2.9,1.75; 3 -2.9,1.25; 4 -2.9,0.75; 5 -2.9,0.25; 6 -2.9,-0.25; 7 -2.9,-0.75; 8 -2.9,-1.25; 9 -2.9,-1.75; 10 -2.9,-2.25; 21 2.9,-2.25; 22 2.9,-1.75; 23 2.9,-1.25; 24 2.9,-0.75; 25 2.9,-0.25; 26 2.9,0.25; 27 2.9,0.75; 28 2.9,1.25; 29 2.9,1.75; 30 2.9,2.25 | smd 0.3 x 0.8: 11 -2.25,-2.9; 12 -1.75,-2.9; 13 -1.25,-2.9; 14 -0.75,-2.9; 15 -0.25,-2.9; 16 0.25,-2.9; 17 0.75,-2.9; 18 1.25,-2.9; 19 1.75,-2.9; 20 2.25,-2.9; 31 2.25,2.9; 32 1.75,2.9; 33 1.25,2.9; 34 0.75,2.9; 35 0.25,2.9; 36 -0.25,2.9; 37 -0.75,2.9; 38 -1.25,2.9; 39 -1.75,2.9; 40 -2.25,2.9 | smd 4.13 x 4.13: 41 0,0
MSOP8 = smd 0.4 x 1.1: 1 -0.975,-2.25; 2 -0.325,-2.25; 3 0.325,-2.25; 4 0.975,-2.25; 5 0.975,2.25; 6 0.325,2.25; 7 -0.325,2.25; 8 -0.975,2.25
DFN10 = smd 0.6 x 0.25: 1 -1.25,1; 2 -1.25,0.5; 3 -1.25,0; 4 -1.25,-0.5; 5 -1.25,-1; 6 1.25,-1; 7 1.25,-0.5; 8 1.25,0; 9 1.25,0.5; 10 1.25,1 | smd 1.2 x 1.9: 11 0,0
QFN20_ASYM_CORNER = smd 0.7 x 0.25: 1 -1.4,1.25; 2 -1.4,0.75; 3 -1.4,0.25; 4 -1.4,-0.25; 5 -1.4,-0.75; 6 -1.4,-1.25; 11 1.4,-1.25; 12 1.4,-0.75; 13 1.4,-0.25; 14 1.4,0.25; 15 1.4,0.75; 16 1.4,1.25 | smd 0.25 x 0.7: 7 -0.75,-1.9; 8 -0.25,-1.9; 9 0.25,-1.9; 10 0.75,-1.9; 17 0.75,1.9; 18 0.25,1.9; 19 -0.25,1.9; 20 -0.75,1.9 | smd 1.65 x 2.65: 21 0,0 | smd 0.375 x 0.375: M1 -1.312,1.812; M2 1.312,1.812; M3 -1.312,-1.812; M4 1.312,-1.812

### Placement (x,y rotation side)
C1  8.5,46.3 180 top
C2  17.3,39.9 270 top
C3  21.7,45.9 0 top
C4  21.7,47.6 0 top
C5  4.5,26.8 180 top
C6  13.2,17.7 270 top
C7  20.6,20.9 0 top
C8  4.5,12.6 180 top
C9  18.8,32.5 90 top
C10  4.5,20 180 top
C11  4.5,21.7 180 top
C12  9.9,17.7 270 top
C13  17.1,32.5 90 top
C14  15.4,32.5 90 top
C15  36.5,36 180 top
C16  36.5,44 0 top
C17  22.5,38.3 270 top
C18  22.5,41.7 90 top
C19  13.7,32.5 90 top
C20  8.6,32.5 90 top
C21  25,37.4 180 top
C22  26,50.3 270 top
C23  14.9,53.2 270 top
C24  21.7,44.2 0 top
C25  20.8,41.7 270 top
C26  16.6,53.2 270 top
C27  32.1,61.4 90 top
C28  13.2,53.2 270 top
C29  24.3,50.3 270 top
C30  27.7,50.3 270 top
C31  30.8,55.2 0 top
C32  20.9,57 0 top
C33  30.8,48.4 0 top
C34  3.5,52.4 180 top
C35  3.6,56 90 top
C36  20.2,52 0 top
C37  13,57.9 90 top
C38  29.9,62.1 90 top
C39  21.5,23.4 270 top
C40  56.5,61 270 bottom
C41  24.9,14.8 180 top
C42  24.9,11.4 0 top
C43  21.5,26.8 270 top
C44  56.5,24 270 bottom
C45  31.4,14.8 0 top
C46  31.4,11.4 180 top
CON1  2,48 270 top
CON2  50,21.5 90 top
CON3  50,58.5 90 top
CON4  20,66 270 top
CON5  10.5,2 0 top
CON6  16.5,2 0 top
D1  25,45.9 0 top
D2  27,62.1 90 top
D3  10,77.1 180 top
F1  24.1,62.1 90 top
JP1  3.5,35 270 top
L1  6.2,55.6 180 top
L4  24.9,16.5 0 top
L5  24.9,13.1 180 top
L7  31.4,16.5 180 top
L8  31.4,13.1 0 top
L20  19.8,54.6 90 top
LOGO1  34.6,32 0 top
R1  25.5,74.1 270 top
R2  1K Ohms  [RES0603]  8.5,49.7 0 top
R3  1K Ohms  [RES0603]  8.5,48 0 top
R4  25,47.6 180 top
R5  4.5,25.1 180 top
R6  4.5,23.4 180 top
R7  51.2,37 0 top
R8  47.9,37 0 top
R9  51.2,43 0 top
R10  47.9,43 0 top
R11  37.4,33.5 270 top
R12  35.6,46.5 90 top
R13  35,21.5 90 bottom
R14  39.5,21.5 90 bottom
R15  44,21.5 90 bottom
R16  39.5,58.5 90 bottom
R17  44,58.5 90 bottom
R18  35,58.5 90 bottom
R19  35.6,33.5 270 top
R20  37.4,46.5 90 top
R21  25,39.1 0 top
R22  25,40.9 0 top
R23  12,32.5 90 top
R24  10.3,32.5 90 top
R25  20.9,58.8 0 top
R26  17.6,58.8 0 top
R27  30.8,46.7 0 top
R28  30.8,45 180 top
R29  30.8,53.5 180 top
R30  6.8,52.4 180 top
R31  10.1,52.4 180 top
R32  30.8,50.1 180 top
R33  30.8,51.8 0 top
R34  10,75.4 0 top
R35  19.8,23.4 270 top
R36  24.9,9.7 180 top
R37  19.8,26.8 270 top
R38  31.4,9.7 0 top
R39  47K Ohms  [RES0603]  8.5,42.9 0 top
R40  47K Ohms  [RES0603]  8.5,44.6 0 top
R41  8.5,39.5 0 top
R42  8.5,41.2 0 top
RFCON1  32.2,4.8 90 top
RFCON2  24.1,4.8 90 top
TC1  32.2,74.1 0 top
U1  15.4,46 0 top
U2  4.5,16.3 270 top
U3  13.1,25.1 0 top
U4  31.5,40 90 top
U5  10.1,55.2 0 top
U6  25.5,55.4 270 top

### Tracks (layer width: path | path; a pad name or v marks a point on that pad's centre or on a via)
3V3  (via drill 0.3, 0.3 pad 0.65, 0.3 pad 0.7, 0.3 pad 0.85)
  Top 0.2: U3.8 7.55,23.85 v6.2,22.5 | v2.6,23.4 R6.2
  Top 0.254: U5.3 8.2,55.2 7.55,54.55 L1.2
  Top 0.305: U1.20 v19.75,45.75 19.9,45.9 C3.1 | 5.37,26.85 C5.1 6.02,27.5 8.3,27.5 8.95,26.85 U3.2 | U1.4 v10.3,46.25 | U1.15 16.65,42.85 16.4,42.6 | U1.14 16.15,42.85 16.4,42.6 | C2.1 16.4,41.62 v16.4,41.8 16.4,42.6 | U1.11 14.65,41.85 v14.6,41.8 14,41.2 R42.2 | v15.6,51.2 15.65,51.15 U1.28 | C35.1 1.95,54.45 v1.9,54.5 | v10.8,74 10.8,75.38 R34.2 | TC1.1 29.39,73.2 25.58,73.2 R1.2 22.82,73.28 22.1,74 v15.8,74
  Top 0.406: R5.2 3.68,25.16 5.37,26.85
  Top 0.61: v10.3,46.25 9.37,46.25 C1.1 | R41.2 9.32,37.72 v8.5,36.9 7.86,37.54 JP1.4 | C5.1 5.32,27.88 6.9,29.46 v6.9,31.7
  Top 0.813: R6.2 R5.2 | C1.1 R40.2 R39.2 R42.2 R41.2 | R30.2 6,52.38 v6,51.1
  Bottom 0.2: v6.2,22.5 3.5,22.5 v2.6,23.4
  Bottom 0.305: v19.75,45.75 18.95,44.95 18.95,44.35 v16.4,41.8 v14.6,41.8 | v1.9,54.5 1.9,65.1 v10.8,74 v15.8,74 | v15.6,51.2 14.6,52.2 10.4,52.2 9.3,51.1
  Bottom 0.61: v6,51.1 9.3,51.1 11.2,49.2 11.2,47.65 10.3,46.75 v10.3,46.25 | v6.9,31.7 6.9,35.3 v8.5,36.9
  pour Top (no thermals): 7.2,55.1 2.8,55.1 2.8,53.8 3.2,53.8 4,53 4,52 6.3,52 6.3,53 7.2,53.9
3V3_FB
  Top 0.254: U5.4 8.3,54.7 7.8,54.2 7.8,52.58 R30.1
  Top 0.813: R30.1 R31.2
3V3_SOFTSTART
  Top 0.254: U5.6 13.02,54.2 C28.1
3V3_SW
  pour Top (no thermals): 9.1,56.1 9.1,56.5 8.3,57.3 5.1,57.3 5.1,56.1
5V0  (via drill 0.3, 0.3 pad 0.65, 0.3 pad 0.7, 0.3 pad 0.85)
  Top 0.2: U2.4 3.55,15.95 3.9,16.3 5.1,16.3 5.45,15.95 U2.6 | U5.2 7.9,55.7 v7.8,55.6
  Top 0.254: U6.2 26.25,57.65 v26.6,58
  Top 0.305: U3.22 16.95,23.35 19.4,20.9 C7.1 | U3.33 14.35,28.85 14.8,29.3 17.3,29.3 18.8,30.8 C9.1 | C37.1 11.92,57.08 v11.9,57.1 | U3.14 12.35,21.05 v12.5,20.9 12.5,19.3 13.2,18.6 C6.1
  Top 0.406: C21.1 26.7,37.4 28.32,39.02 U4.8 30.68,39.02 v31.5,38.2 | R27.2 29.98,48.34 C33.1
  Top 0.508: C8.1 5.45,12.73 v5.45,13.8 U2.6 | v8,20.2 v9.65,21.85
  Top 0.61: v20.2,31.7 20.18,31.68 C9.1 | v16.7,20.9 C7.1
  Top 0.813: R32.2 C33.1 v28.7,48.4 | C36.1 18.65,50.75 19.6,49.8 v20.5,49.8 | v31.5,41.7 v31.5,38.2
  Bottom 0.2: v7.8,55.6 8.6,56.4 11.2,56.4 v11.9,57.1
  Bottom 0.254: v26.6,58 26,57.4 25.24,57.4 24.08,56.24 24.08,54.66 25.14,53.6 26.8,53.6 27.3,53.1 27.3,49.8
  Bottom 0.508: v5.45,13.8 5.45,17.65 v8,20.2
  Bottom 0.61: v20.2,31.7 17.9,29.4 10.4,29.4 9.2,28.2 9.2,22.3 v9.65,21.85 10.6,20.9 v12.5,20.9 v16.7,20.9 | JP1.2 2.8,42.05 2.8,51.4 4.9,53.5 13.2,53.5 v14.9,55.2
  Bottom 0.813: v20.5,49.8 27.3,49.8 v28.7,48.4 31.5,45.6 v31.5,41.7 | v31.5,38.2 25,31.7 v20.2,31.7
  pour Top (no thermals): 19.3,51.2 19.3,55.6 17.5,57.4 12.6,57.4 12.6,56.4 11.9,55.7 11.2,55.7 11.2,55.2 13.7,55.2 14.5,54.4 14.5,53.7 17.2,53.7 18.1,52.8 18.1,51.2
5V0_BST
  Top 0.254: U6.7 22.57,56.15 C32.2
5V0_FB  (via drill 0.3)
  Top 0.254: R33.2 v32.7,51.8 | U6.19 28.35,55.65 v28.6,55.9 28.35,56.15 U6.20
  Top 0.813: C33.2 R32.1 R33.2
  Bottom 0.254: v32.7,51.8 v28.6,55.9
5V0_INTVCC  (via drill 0.3)
  Top 0.254: U6.15 26.25,53.25 v26.6,52.9 27.7,51.8 C30.1 | U6.3 25.75,57.95 v25.7,58
  Bottom 0.254: v25.7,58 25.3,58 23.7,56.4 23.7,54.5 25.3,52.9 v26.6,52.9
5V0_RT
  Top 0.254: U6.17 28.15,54.65 29.3,53.5 R29.2
5V0_SS
  Top 0.254: U6.18 29.93,55.15 C31.1
5V0_SW
  pour Top (no thermals): 23.9,55.7 21.2,55.7 20.5,56.4 20.5,57.5 19.7,57.5 19.7,56.3 20.2,55.8 20.2,53.5 21.4,53.5 22.5,54.6 23.9,54.6
5V0_VSENSE  (via drill 0.3)
  Top 0.254: U1.18 18.55,44.75 v19.7,43.6 20.78,42.52 C25.1 | v28.7,45 R28.2
  Top 0.813: R27.1 R28.2
  Bottom 0.254: v19.7,43.6 21.1,45 v28.7,45
!AFE_CS  (via drill 0.3)
  Top 0.2: U3.5 6.65,25.35 v6.6,25.4 6.3,25.1 R5.1 | U1.32 13.65,49.15 13.2,49.6 13,49.6 v12.4,50.2
  Bottom 0.2: v12.4,50.2 12.4,47 11.83,46.43 11.83,34.74 6.57,29.48 6.57,27.79 5.5,26.73 5.5,25.8 5.9,25.4 v6.6,25.4
!AFE_IRQ  (via drill 0.3)
  Top 0.2: R6.1 6.2,23.4 v7.1,24.3 7.15,24.35 U3.7 | U1.3 11.65,46.75 v11.5,46.9
  Bottom 0.2: v11.5,46.9 11.5,34.88 6.24,29.61 6.24,27.93 5.17,26.86 5.17,24.83 6.1,23.9 6.7,23.9 v7.1,24.3
!RESET  (via drill 0.3)
  Top 0.2: U1.9 13.65,42.65 v13.9,42.4 | v24.2,74.9 25.48,74.9 R1.1 25.58,75 29.39,75 TC1.10
  Bottom 0.2: v13.9,42.4 16.3,42.4 18.33,44.43 18.33,51.89 17.35,52.87 17.35,71.97 20.29,74.9 v24.2,74.9
AFE_ADC_EXT_REF
  Top 0.305: C10.1 6.4,20 7.1,20.7 7.1,21.5 8.45,22.85 U3.10
  Top 0.508: U2.1 5.45,19.87 C10.1
AFE_ADC_INT_REF
  Top 0.305: U3.9 8.14,23.35 6.49,21.7 C11.1
AFE_DAC_REF
  Top 0.305: C12.1 10.85,19.47 U3.11
AFE_MISO  (via drill 0.3)
  Top 0.2: U3.6 6.65,24.85 v6.3,24.5 | U1.30 14.65,49.56 v14,50.2
  Bottom 0.2: v14,50.2 13.05,49.25 13.05,46.73 12.48,46.16 12.48,34.47 7.22,29.21 7.22,27.52 6.67,26.97 6.67,26.43 7.2,25.9 7.2,25.2 6.5,24.5 v6.3,24.5
AFE_MOSI  (via drill 0.3)
  Top 0.2: U3.3 7.55,26.35 v7.2,26.7 | U1.29 15.15,49.85 v14.8,50.2
  Bottom 0.2: v14.8,50.2 13.38,48.78 13.38,46.59 12.81,46.02 12.81,34.33 7.55,29.07 7.55,27.05 v7.2,26.7
AFE_SCLK  (via drill 0.3)
  Top 0.2: U1.31 14.15,49.25 v13.2,50.2 | U3.4 7.15,25.85 6.9,26.1 v6.2,26.1
  Bottom 0.2: v13.2,50.2 12.73,49.73 12.73,46.87 12.15,46.29 12.15,34.6 6.89,29.34 6.89,27.65 6.35,27.11 6.35,26.25 v6.2,26.1
EN1  (via drill 0.3)
  Top 0.2: JP1.7 1.1,33.59 1.1,41.2 2.6,42.7 v4.2,42.7 | U1.6 11.15,45.25 v10.5,44.6
  Bottom 0.2: v4.2,42.7 4.8,43.3 7.86,43.3 9.16,44.6 v10.5,44.6
EN2  (via drill 0.3)
  Top 0.2: JP1.8 3.7,33.53 3.7,40.6 v5,41.9 | U1.8 11.75,44.25 v10.5,43
  Bottom 0.2: v10.5,43 8.49,43 8.13,42.65 5.75,42.65 v5,41.9
EN3  (via drill 0.3)
  Top 0.2: JP1.9 0.77,31.38 0.77,41.42 2.78,43.43 4.1,43.43 v4.2,43.53 | U1.5 10.85,45.75 v10.5,45.4
  Bottom 0.2: v4.2,43.53 4.3,43.63 7.73,43.63 9.5,45.4 v10.5,45.4
EN4  (via drill 0.3)
  Top 0.2: JP1.10 3.37,31.32 3.37,41.07 v5,42.7 | U1.7 11.45,44.75 v10.5,43.8
  Bottom 0.2: v5,42.7 5.27,42.97 8,42.97 8.82,43.8 v10.5,43.8
GND  (via drill 0.3, 3 pad 5.5)
  Top 0.254: U6.12 24.75,54.65 25.25,55.15 | U6.13 25.25,55.15 | 25.25,55.15 25.45,55.35 | 25.45,55.35 U6.21 24.75,56.15 U6.5 | U6.4 25.25,55.55 25.45,55.35 | U5.7 10.6,54.7 U5.11
  Top 0.305: U3.15 12.85,24.85 U3.41 14.85,26.85 U3.32
  other vias: 67,77 67,3 67,40 3,3 3,77 10.2,28 18,28.5 17.2,28.5 16.4,28.5 14.2,47.3 16.7,47.3 16.7,44.7 14.2,44.7 15.4,46 11.6,23.6 11.6,26.6 14.6,26.6 14.6,23.6 13.1,25.1 32.2,73.47 26.3,55 26.3,55.8 24.7,55.8 24.7,55 10.1,55.7 10.1,54.7 13.4,41.8 10.6,42 17.2,41.7 19,48.5 16.4,51.2 11.1,51.2 11.9,51.2 12.7,51.2 13.5,51.2 14.3,51.2 23.4,46.7 20.5,51.3 20.5,52.1 20.5,52.9 16.9,21.9 16.1,21.9 8.1,59.7 8.9,59.7 9.7,59.7 10.5,59.7 11.3,59.7 8.1,58.1 8.9,58.1 9.7,58.1 10.5,58.1 11.3,58.1 8.1,58.9 8.9,58.9 9.7,58.9 10.5,58.9 11.3,58.9 2.8,59.1 3.6,59.1 4.4,59.1 2.8,56.3 3.6,56.3 4.4,56.3 1.3,51.5 1.3,52.3 1.3,53.1 3.9,51 4.7,51 5.4,45.3 4.6,45.3 3.8,45.3 5.4,46.1 4.6,46.1 3.8,46.1 23,52.4 23,50.8 23,51.6 27.1,47.5 27.1,45.9 27.1,46.7 23.9,44.3 24.7,44.3 25.5,44.3 26.3,44.3 27.1,44.3 23.9,42.7 24.7,42.7 25.5,42.7 26.3,42.7 27.1,42.7 23.9,43.5 24.7,43.5 25.5,43.5 26.3,43.5 27.1,43.5 18.2,34.6 14.2,34.6 15,34.6 15.8,34.6 16.6,34.6 17.4,34.6 10.3,34.6 7.9,34.6 8.7,34.6 9.5,34.6 2.5,27 2.5,24.6 2.5,25.4 2.5,26.2 2.5,11 2.5,11.8 2.5,12.6 2.5,15.8 2.5,13.4 2.5,14.2 2.5,15 2.5,19 2.5,16.6 2.5,17.4 2.5,18.2 2.5,22.2 2.5,19.8 2.5,20.6 2.5,21.4 21,37.7 19.4,36.1 20.2,36.9 22.3,35.9 23.1,35.9 23.9,35.9 24.7,35.9 25.5,35.9 22.3,34.3 23.1,34.3 23.9,34.3 24.7,34.3 25.5,34.3 22.3,35.1 23.1,35.1 23.9,35.1 24.7,35.1 25.5,35.1 22.8,20.8 22.8,21.6 22.8,22.4 22.8,23.2 22.8,24 19.6,19.7 20.4,19.7 21.2,19.7 22.8,26.4 22.8,27.2 22.8,28 22.8,13.8 22.8,14.6 22.8,15.4 22.8,16.2 22.8,17 22,13.8 22,14.6 22,15.4 22,16.2 22,17 29.2,1.8 28.4,1.8 27.6,1.8 26.8,1.8 26,1.8 29.2,1 28.4,1 27.6,1 26.8,1 26,1 28.5,2.6 28.5,3.4 28.5,4.2 28.5,5 28.5,5.8 27.7,2.6 27.7,3.4 27.7,4.2 27.7,5 27.7,5.8 25.2,1 25.2,1.8 22.8,1.8 22,1.8 21.2,1.8 24.4,1 23.6,1 22.8,1 22,1 21.2,1 20.4,1 20.4,1.8 20.4,2.6 20.4,3.4 20.4,4.2 19.6,1 19.6,1.8 19.6,2.6 19.6,3.4 19.6,4.2 21.2,7.4 20.4,7.4 19.6,7.4 19.6,5.8 19.6,5 21.2,6.6 20.4,6.6 19.6,6.6 20.4,5.8 20.4,5 22.8,6.6 22.8,7.4 22.8,8.2 22.8,9 22,6.6 22,7.4 22,8.2 22,9 22.8,9.8 22.8,10.6 22.8,11.4 22.8,12.2 22.8,13 22,9.8 22,10.6 22,11.4 22,12.2 22,13 34.8,12.2 34.8,13 34,12.2 34,13 34,13.8 37.2,7.4 36.4,7.4 35.6,7.4 34.8,7.4 34,7.4 37.2,6.6 36.4,6.6 35.6,6.6 34.8,6.6 34,6.6 34.8,8.2 34.8,9 34.8,9.8 34.8,10.6 34.8,11.4 34,8.2 34,9 34,9.8 34,10.6 34,11.4 36.4,5.8 36.4,5 36.4,4.2 36.4,3.4 36.4,2.6 37.2,5.8 37.2,5 37.2,4.2 37.2,3.4 37.2,2.6 28.5,6.6 28.5,7.4 28.5,8.2 28.5,9 28.5,9.8 27.7,6.6 27.7,7.4 27.7,8.2 27.7,9 27.7,9.8 37.2,1.8 36.4,1.8 35.6,1.8 34.8,1.8 34,1.8 37.2,1 36.4,1 35.6,1 34.8,1 34,1 30.8,1.8 30,1.8 33.2,1 32.4,1 31.6,1 30.8,1 30,1 28.5,10.6 28.5,11.4 28.5,12.2 28.5,13 28.5,13.8 27.7,10.6 27.7,11.4 27.7,12.2 27.7,13 27.7,13.8 28.5,14.6 28.5,15.4 28.5,16.2 28.5,17 28.5,17.8 27.7,14.6 27.7,15.4 27.7,16.2 27.7,17 27.7,17.8 17.1,8.5 17.1,9.3 17.1,10.1 17.1,10.9 17.1,11.7 16.3,8.5 16.3,9.3 16.3,10.1 16.3,10.9 16.3,11.7 13.7,12.5 13.7,13.3 13.7,14.1 13.7,14.9 13.7,15.7 12.9,12.5 12.9,13.3 12.9,14.1 12.9,14.9 12.9,15.7 17.1,12.5 17.1,13.3 17.1,14.1 17.1,14.9 17.1,15.7 16.3,12.5 16.3,13.3 16.3,14.1 16.3,14.9 16.3,15.7 13.7,8.5 13.7,9.3 13.7,10.1 13.7,10.9 13.7,11.7 12.9,8.5 12.9,9.3 12.9,10.1 12.9,10.9 12.9,11.7 13.7,4.5 13.7,5.3 13.7,6.1 13.7,6.9 13.7,7.7 12.9,4.5 12.9,5.3 12.9,6.1 12.9,6.9 12.9,7.7 10.1,8.5 10.1,9.3 10.1,10.1 10.1,10.9 10.1,11.7 9.3,8.5 9.3,9.3 9.3,10.1 9.3,10.9 9.3,11.7 10.1,12.5 10.1,13.3 10.1,14.1 10.1,14.9 10.1,15.7 9.3,12.5 9.3,13.3 9.3,14.1 9.3,14.9 9.3,15.7 2.5,10.2 6.5,11 5.7,11 4.9,11 4.1,11 3.3,11 6.5,10.2 5.7,10.2 4.9,10.2 4.1,10.2 3.3,10.2 42.7,42.6 43.5,42.6 44.3,42.6 45.1,42.6 45.9,42.6 42.7,43.4 43.5,43.4 44.3,43.4 45.1,43.4 45.9,43.4 42.7,36.6 43.5,36.6 44.3,36.6 45.1,36.6 45.9,36.6 42.7,37.4 43.5,37.4 44.3,37.4 45.1,37.4 45.9,37.4 36.5,37 36.5,37.8 36.5,42.2 36.5,43 30.5,40.9 29.2,41.8 20.4,39.6 19.6,39.6 19.6,40.4 19.6,41.2 16.9,37.9 17.7,37.9 6.4,41.2 6.4,42 6.4,46.3 6.4,47.1 14,58.4 14,59.2 14.8,58.4 14.8,59.2 15.6,58.4 15.6,59.2 31.1,65.9 31.9,65.9 32.7,65.9 31.9,64.3 32.7,64.3 31.1,66.7 31.9,66.7 32.7,66.7 31.9,65.1 32.7,65.1 27.1,65.9 27.9,65.9 28.7,65.9 29.5,65.9 30.3,65.9 27.1,66.7 27.9,66.7 28.7,66.7 29.5,66.7 30.3,66.7 23.1,65.9 23.9,65.9 24.7,65.9 25.5,65.9 26.3,65.9 23.1,66.7 23.9,66.7 24.7,66.7 25.5,66.7 26.3,66.7 29.2,61.7 30,61.7 30.8,61.7 29.2,62.5 30,62.5 30.8,62.5 28.4,57.3 29.2,57.3 30,57.3 30.8,57.3 31.6,57.3 28.4,58.1 29.2,58.1 30,58.1 30.8,58.1 31.6,58.1 19.6,28.8 20.4,28.8 21.2,28.8 22,28.8 22.8,28.8 28.6,52.3 28.6,53.1 28,53.6 23,58.5 18.6,57.3 56.3,40.9 57.1,40.9 57.9,40.9 58.7,40.9 59.5,40.9 56.3,39.3 57.1,39.3 57.9,39.3 58.7,39.3 59.5,39.3 56.3,40.1 57.1,40.1 57.9,40.1 58.7,40.1 59.5,40.1 30.2,34.6 31,34.6 31.8,34.6 32.6,34.6 33.4,34.6 30.2,33 31,33 31.8,33 32.6,33 33.4,33 30.2,33.8 31,33.8 31.8,33.8 32.6,33.8 33.4,33.8 19.9,46.5 1.4,48.8 1.4,48 1.4,47.2 0.6,48.8 0.6,48 0.6,47.2 1.4,44.5 1.4,43.7 1.4,42.9 0.6,44.5 0.6,43.7 0.6,42.9 1.7,23 1.7,26.2 1.7,23.8 1.7,24.6 1.7,25.4 2.5,27.8 1.7,27 1.7,27.8 1.7,11 1.7,11.8 1.7,12.6 1.7,15.8 1.7,13.4 1.7,14.2 1.7,15 1.7,19 1.7,16.6 1.7,17.4 1.7,18.2 1.7,22.2 1.7,19.8 1.7,20.6 1.7,21.4 1.7,10.2 12.9,30.6 12.1,30.6 7.7,32.5 6,33.7 5.9,31.2 13.4,40.6
  pour Top (rank 6): -1,81 71,81 71,-1 -1,-1
  pour Bottom (rank 6): -2,82 72,82 72,-2 -2,-2
  pour Bottom (no thermals): 48.2,60.1 60,60.1 60,56.9 48.2,56.9
  pour Bottom (no thermals): 48.2,23.1 60,23.1 60,19.9 48.2,19.9
  pour Top (no thermals): 48.2,23.1 51.8,23.1 51.8,19.9 48.2,19.9
  pour Top (no thermals): 48.2,60.1 51.8,60.1 51.8,56.9 48.2,56.9
I2C0_SCL  (via drill 0.3)
  Top 0.2: U1.2 12.25,47.25 11.5,48 v10.4,48 R3.2 | v6.4,44.6 6.4,44.18 R39.1
  Bottom 0.2: v10.4,48 10,48 6.6,44.6 v6.4,44.6
I2C0_SDA  (via drill 0.3)
  Top 0.2: R40.1 6.88,45.4 v6.4,45.4 | U1.1 12.25,47.75 11.2,48.8 v10.4,48.8 10.22,48.8 R2.2
  Bottom 0.2: v10.4,48.8 10.3,48.8 6.9,45.4 v6.4,45.4
I2C1_SCL  (via drill 0.3)
  Top 0.2: U1.17 18.45,44.25 19,43.7 v19,42.9 | v6.6,39.5 R41.1 | v10.5,39.2 10.8,39.5 15.2,39.5 v15.9,38.8
  Bottom 0.2: JP1.6 6.33,36.56 6.33,39.23 v6.6,39.5 10.2,39.5 v10.5,39.2 | v15.9,38.8 16.6,39.5 17.1,39.5 19,41.4 v19,42.9
I2C1_SDA  (via drill 0.3)
  Top 0.2: U1.16 17.15,42.85 v18,42 | R42.1 6.78,40.3 v6.6,40.3 | v10.5,40.1 10.77,39.83 15.67,39.83 v15.9,39.6
  Bottom 0.2: JP1.5 3.43,36.2 5.5,36.2 6,36.7 6,39.7 v6.6,40.3 7.07,39.83 10.23,39.83 v10.5,40.1 | v15.9,39.6 16.13,39.83 16.96,39.83 18,40.86 v18,42
LED
  Top 0.2: U1.24 19.15,47.75 20,48.6 23.18,48.6 R4.2
N$1
  Top 0.406: U4.6 27.57,40.33 27,40.9 R22.2
N$2
  Top 0.254: R24.2 12.86,35.88 17.5,35.88 C18.1
  Top 0.813: R22.1 24.16,40.88 C18.1
N$3
  Top 0.406: R21.2 27,39.1 27.57,39.67 U4.7
N$4
  Top 0.61: CON1.2 R3.1
N$5
  Top 0.254: C17.1 21.28,39.12 17.66,35.5 14.18,35.5 R23.2
  Top 0.813: R21.1 24.16,39.12 C17.1
N$6
  Top 0.305: U1.21 18.73,46.25 20.08,47.6 C4.1
N$8
  Top 0.813: L5.1 C41.1 L4.2
N$10
  Top 0.813: L8.1 C45.1 L7.2
N$19
  Top 1.27: CON4.P$2 24.03,63.5 F1.2
N$25
  Top 0.813: D1.A R4.1
N$38
  Top 0.61: CON1.1 6.98,49 R2.1
N$149
  Top 0.813: R34.1 D3.A
PA1_VD_IN  (via drill 0.3)
  Top 0.406: R19.2 36.1,32.18 36.1,23.9 arc90 38.9,21.1 v39.5,21.1
  Bottom 0.406: v39.5,21.1 R14.1
  pour Bottom (no thermals): 60,8.5 41,8.5 32.5,17 32.5,19.5 47,19.5 48,18.5 60,18.5
PA1_VD_OUT  (via drill 0.3)
  Top 0.406: v39.5,21.9 38.9,21.9 arc-90 36.9,23.9 36.9,32.18 R11.2 | CON2.P$5 52.02,33.52 R7.2
  Bottom 0.406: v39.5,21.9 R14.2
  pour Bottom (no thermals): 60,34.5 41,34.5 32.5,26 32.5,23.5 47,23.5 48,24.5 60,24.5
PA1_VG
  Top 0.813: RFCON2.2 24.08,6.45 R36.2 C42.1 L5.2
PA1_VG_EN  (via drill 0.3)
  Top 0.2: U3.16 13.35,20.35 v13.1,20.1 | U1.13 15.65,41.25 v15,40.6
  Bottom 0.2: v13.1,20.1 12.73,19.73 10.27,19.73 8.2,21.8 8.2,28.8 13.46,34.06 13.46,39.06 v15,40.6
PA1_VG_FLT
  Top 0.305: U3.24 19.67,24.35 R35.1
  Top 0.813: R35.1 C39.1
PA1_VG_RAW
  Top 0.305: U3.23 17.45,23.85 18.72,22.58 R35.2
PA1_VG_SW  (via drill 0.3)
  Top 0.305: U3.25 17.25,24.85 v17.5,25.1 | v24.1,18.3 24.1,16.52 L4.1
  Bottom 0.305: v17.5,25.1 17.5,24.9 v24.1,18.3
PA2_VD_IN  (via drill 0.3)
  Top 0.406: v39.5,58.1 38.9,58.1 arc90 36.9,56.1 36.9,47.82 R20.2
  Bottom 0.406: R16.1 v39.5,58.1
  pour Bottom (no thermals): 60,45.5 41,45.5 32.5,54 32.5,56.5 47,56.5 48,55.5 60,55.5
PA2_VD_OUT  (via drill 0.3)
  Top 0.406: v39.5,58.9 38.9,58.9 arc90 36.1,56.1 36.1,47.82 R12.2 | CON3.P$4 55.1,58.4 55.1,46.08 R9.2
  Bottom 0.406: R16.2 v39.5,58.9
  pour Bottom (no thermals): 60,71.5 41,71.5 32.5,63 32.5,60.5 47,60.5 48,61.5 60,61.5
PA2_VG
  Top 0.813: RFCON1.2 32.2,9.7 R38.2 C46.1 L8.2
PA2_VG_EN  (via drill 0.3)
  Top 0.2: U3.17 13.85,19.75 v13.6,19.5 | U1.12 15.15,41.55 v14.2,40.6
  Bottom 0.2: v14.2,40.6 13.13,39.53 13.13,34.2 7.87,28.93 7.87,21.66 10.14,19.4 13.5,19.4 v13.6,19.5
PA2_VG_FLT
  Top 0.305: U3.28 17.45,26.35 18.72,27.62 R37.1
  Top 0.813: R37.1 C43.1
PA2_VG_RAW
  Top 0.305: U3.27 19.67,25.85 R37.2
PA2_VG_SW  (via drill 0.3)
  Top 0.305: U3.29 16.85,26.85 v17.5,27.5 | v29.5,18.3 31.5,18.3 32.22,17.58 L7.1
  Bottom 0.305: v17.5,27.5 20.3,27.5 v29.5,18.3
SWCLK  (via drill 0.3)
  Top 0.2: U1.25 17.15,49.15 17.4,49.4 v17.8,49.4
  Bottom 0.2: v17.8,49.4 18,49.6 18,51.76 17.03,52.74 17.03,72.1 20.15,75.23 23.23,75.23 26.5,78.5 29.3,78.5 31.47,76.33 31.47,75.47 v33.47,73.47
SWDIO  (via drill 0.3)
  Top 0.2: U1.26 16.65,49.38 v17.24,49.96 | v31.2,77.5 v30.3,76.6
  Bottom 0.2: v17.24,49.96 17.64,50.36 17.64,51.66 16.7,52.6 16.7,72.24 20.02,75.55 23.09,75.55 26.36,78.83 29.43,78.83 30.76,77.5 v31.2,77.5 | v30.3,76.6 30.93,75.97 v30.93,73.47
SWO  (via drill 0.3)
  Top 0.2: U1.27 16.15,49.81 v17.07,50.73
  Bottom 0.2: v17.07,50.73 17.27,50.93 17.27,51.53 16.37,52.43 16.37,72.37 19.88,75.88 22.96,75.88 26.23,79.15 30.35,79.15 31.9,77.6 31.9,75.8 32.97,74.73 TC1.6
  other vias: 34.74,74.73
TEMP0N  (via drill 0.3)
  Top 0.254: U3.13 11.85,18.55 v12,18.4 | v11,7 CON5.2
  Bottom 0.254: v12,18.4 11.68,18.08 11.68,8.14 11,7.46 v11,7
TEMP0P  (via drill 0.3)
  Top 0.254: U3.12 11.35,18.65 v11.1,18.4 | v10,7 CON5.1
  Bottom 0.254: v11.1,18.4 11.3,18.2 11.3,8.3 v10,7
TEMP1N  (via drill 0.3)
  Top 0.254: U3.20 15.35,18.65 v15.6,18.4 | v17,7 CON6.2
  Bottom 0.254: v15.6,18.4 15.18,17.98 15.18,8.82 v17,7
TEMP1P  (via drill 0.3)
  Top 0.254: U3.19 14.85,18.65 v14.6,18.4 | v16,7 CON6.1
  Bottom 0.254: v14.6,18.4 14.8,18.2 14.8,8.66 16,7.46 v16,7
VIN  (via drill 0.5 pad 0.9)
  Top 0.2: U6.14 25.75,53.05 26,52.8 C22.1
  Top 0.254: U6.6 v24.25,58.2 | U6.11 24.25,52.65 v24.3,52.6
  Top 0.813: R25.2 23.55,60.63 F1.1 24.25,60.48 v24.25,58.2 | v24.3,52.6 C29.1 C22.1 | C27.1 29.93,60.58 C38.1
  Top 1.27: F1.1 26.47,60.63 D2.C 27.45,60.55 C38.1
  Bottom 0.813: v24.25,58.2 22.85,56.8 22.85,54.05 v24.3,52.6
VIN_VSENSE  (via drill 0.3)
  Top 0.254: U1.19 18.95,45.25 v19.7,44.5 20,44.2 C24.1 | R26.2 v18.42,60
  Top 0.813: R25.1 R26.2
  Bottom 0.254: v18.42,60 19.32,59.1 19.32,49.28 20.8,47.8 20.8,45.6 v19.7,44.5
VPA1_ID_SENSE
  Top 0.254: R23.1 11.9,31.68 11.35,31.13 U3.39
  Top 0.813: C19.1 R23.1
VPA1_ID_SENSE_N
  Top 0.406: U4.2 35.32,39.67 arc-90 37.32,37.67 C15.1
  Top 0.813: R11.1 37.32,34.4 C15.1
VPA1_ID_SENSE_P
  Top 0.406: U4.1 34.68,39.02 arc-90 35.68,38.02 C15.2
  Top 0.813: R19.1 35.68,34.4 C15.2
VPA1_VD_SENSE  (via drill 0.3)
  Top 0.254: U3.35 13.35,29.31 14.16,30.12 16.42,30.12 v17.1,30.8 C13.1 | R8.2 48.72,38.18 v48.7,38.2
  Top 0.813: R7.1 R8.2
  Bottom 0.254: v48.7,38.2 47.1,39.8 24.94,39.8 17.1,31.96 v17.1,30.8
VPA2_ID_SENSE
  Top 0.254: R24.1 10.85,31.13 U3.40
  Top 0.813: R24.1 C20.1
VPA2_ID_SENSE_N
  Top 0.406: U4.4 34.68,40.98 arc90 35.68,41.98 C16.1
  Top 0.813: C16.1 35.68,45.6 R12.1
VPA2_ID_SENSE_P
  Top 0.406: U4.3 35.32,40.33 arc90 37.32,42.33 C16.2
  Top 0.813: C16.2 37.32,45.6 R20.1
VPA2_VD_SENSE  (via drill 0.3)
  Top 0.254: U3.36 12.85,29.35 14,30.5 15.1,30.5 v15.4,30.8 C14.1 | R10.2 48.72,41.82 v48.7,41.8
  Top 0.813: R10.2 R9.1
  Bottom 0.254: v48.7,41.8 47.08,40.18 24.78,40.18 v15.4,30.8

### Text on the board
tPlace: DC IN / Max. 24 V | - | + | OUT | + | + | 2 | GND | - | + | IN | + | + | OUT | + | 1 | GND | - | + | IN | + | 1 | 2 | 1 | 2 | IcyRadio PA Bias Controller v1 / Nov 2020